# EasyEDA Pro project Pajero Gauges.epro, schematic Schematic1

## Sheets
1 12V In / Protection: Board Name: PCB1; Create Date: 2026-03-26; Page Name: 12V In / Protection; Project Name: Pajero Gauges Current V2; Schematic Name: Schematic1; Update Date: 2026-03-26; Company: EasyEDA.com; Page Size: A4; Version: V1.0
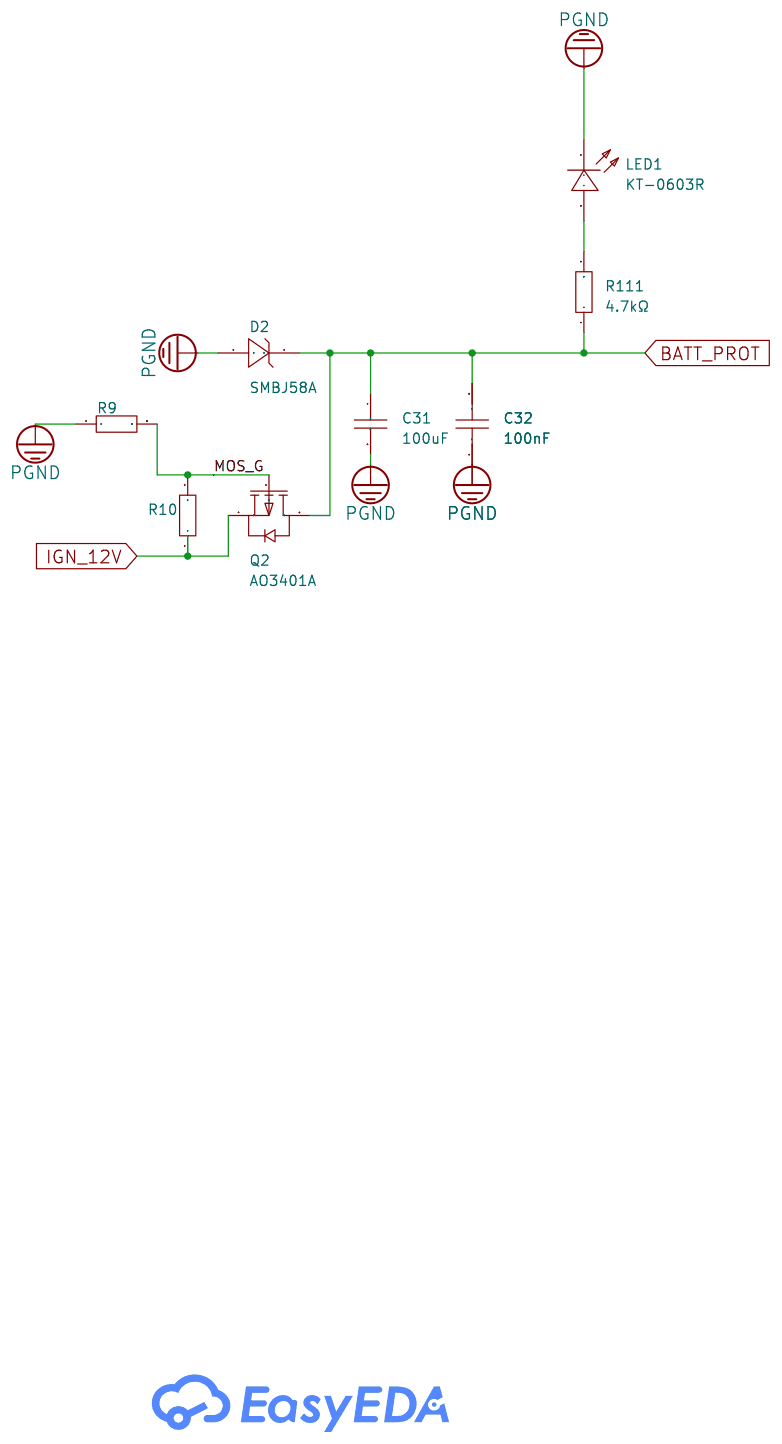
[diagram p0: 12V In / Protection]
2 3.3V Buck: Create Date: 2026-03-25; Page Name: 3.3V Buck; Project Name: Pajero Gauges Current; Update Date: 2026-03-25
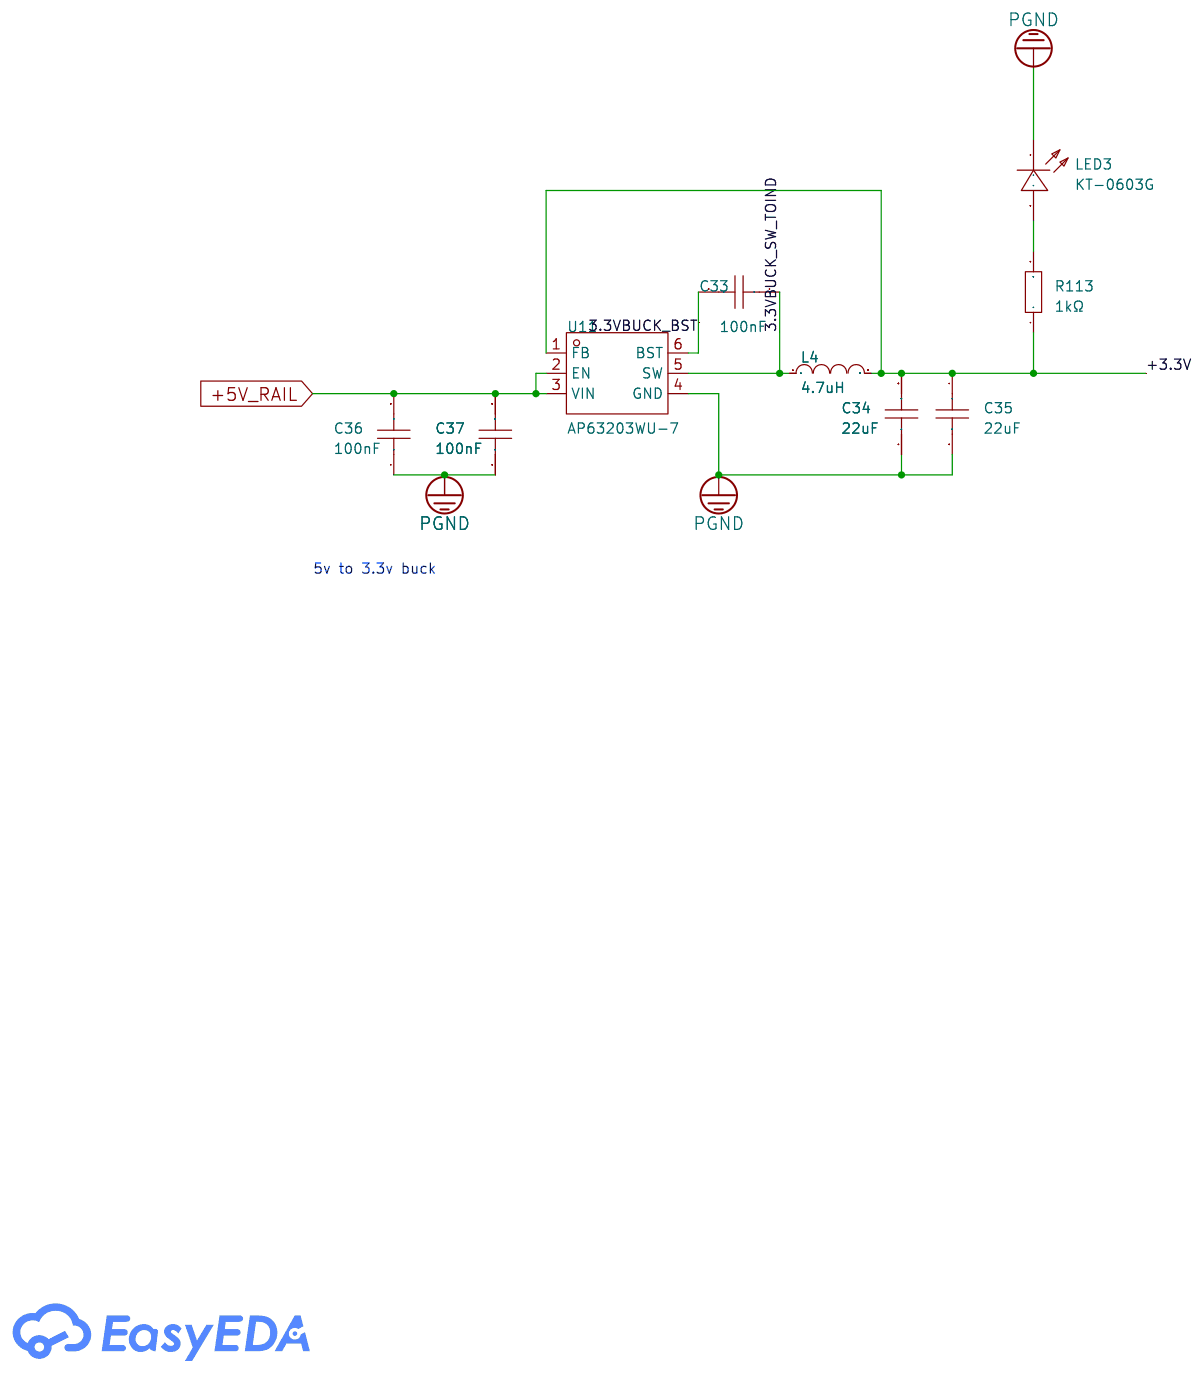
[diagram p1: 3.3V Buck]
3 Thermocouple: Page Name: Thermocouple
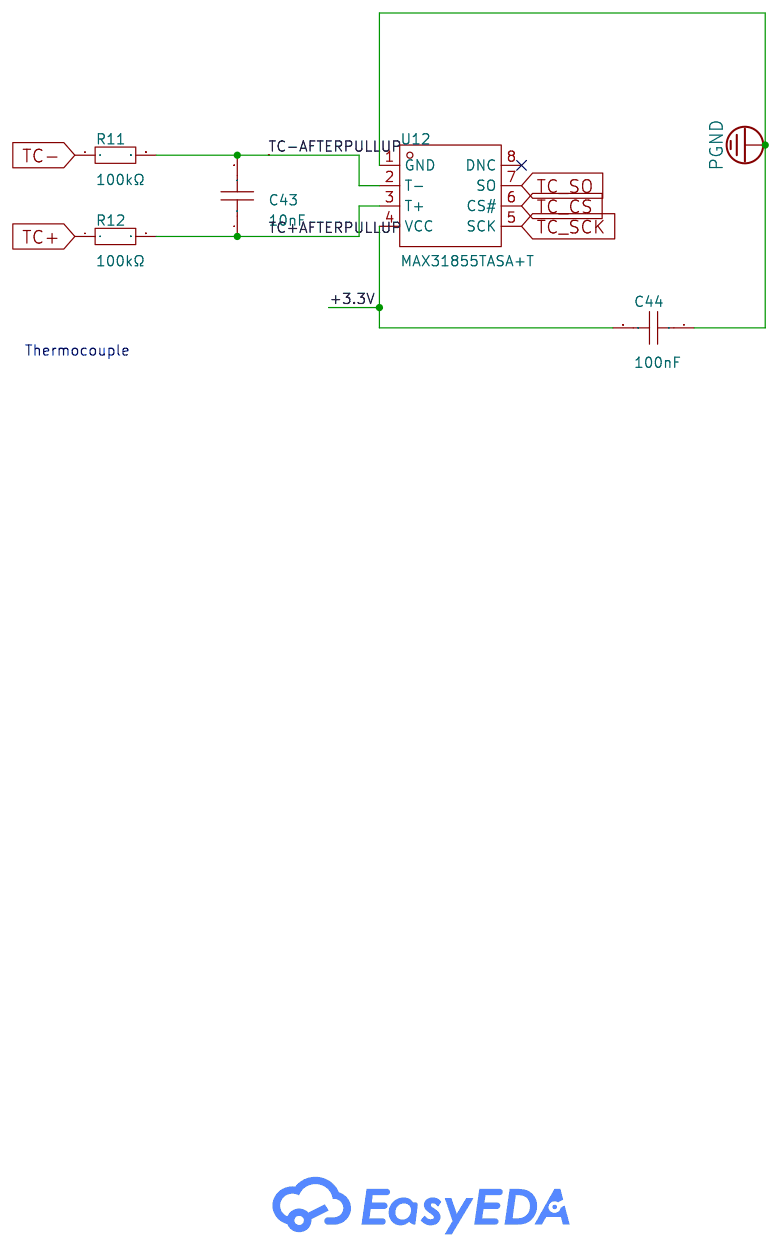
[diagram p2: Thermocouple]
4 Voltage Dividers: Create Date: 2026-03-19; Page Name: Voltage Dividers; Project Name: Pajero Gauges Current; Update Date: 2026-03-20
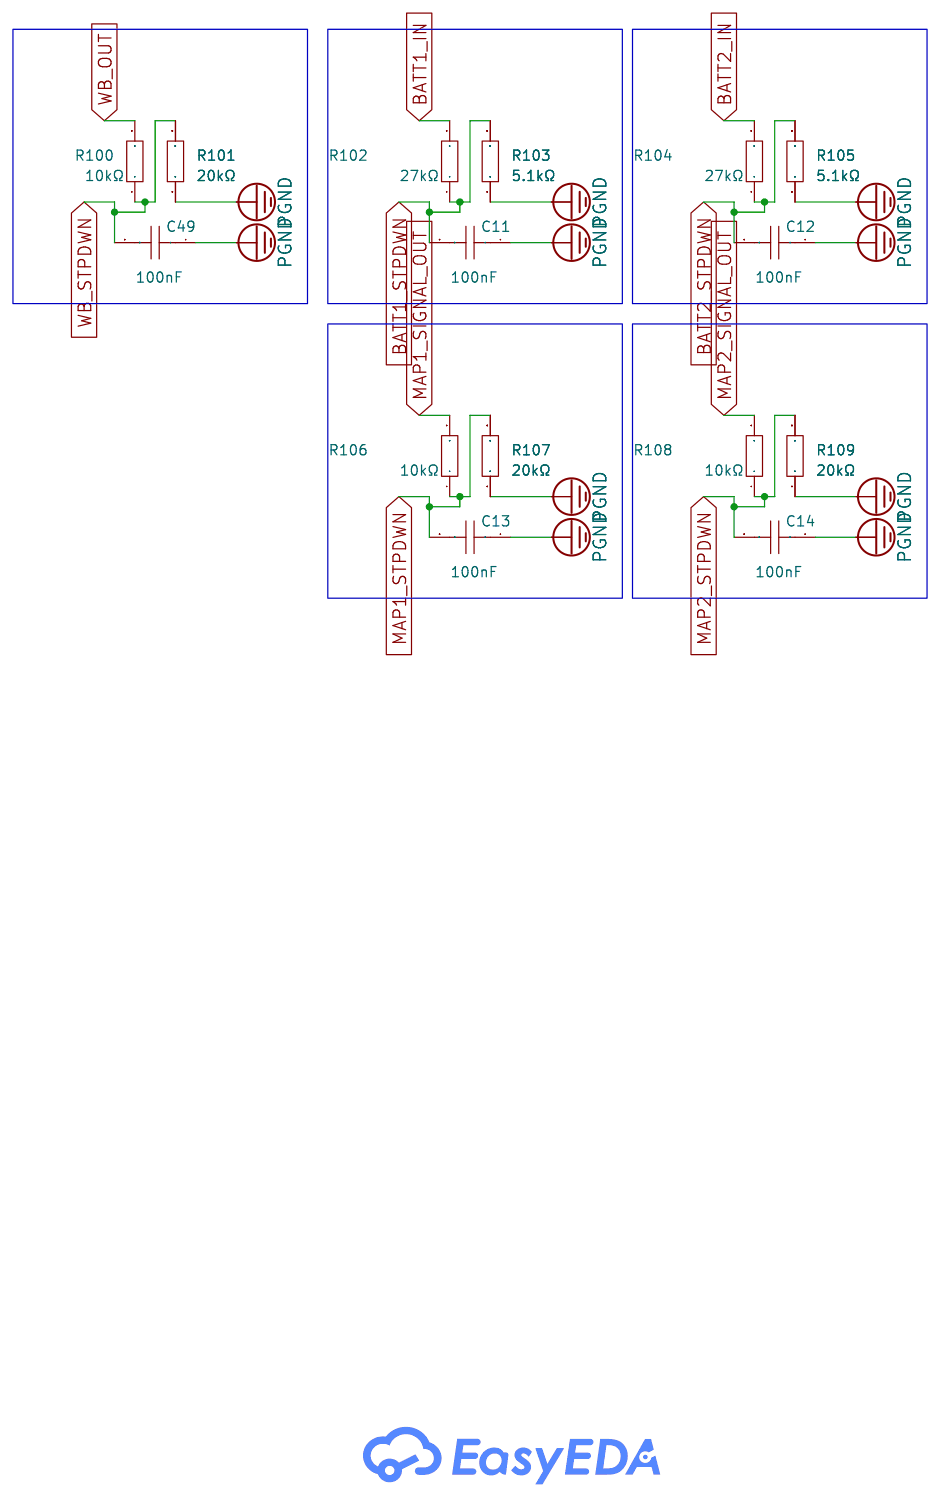
[diagram p3: Voltage Dividers]
5 Wideband: Create Date: 2026-03-20; Page Name: P1; Project Name: Project Name; Schematic Name: Schematic Name; Update Date: 2021.11.05
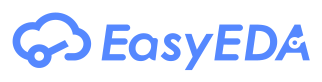
[diagram p4: Wideband]
6 OLEDs: Create Date: 2026-03-20; Page Name: OLEDs; Project Name: Pajero Gauges Current; Update Date: 2026-03-23
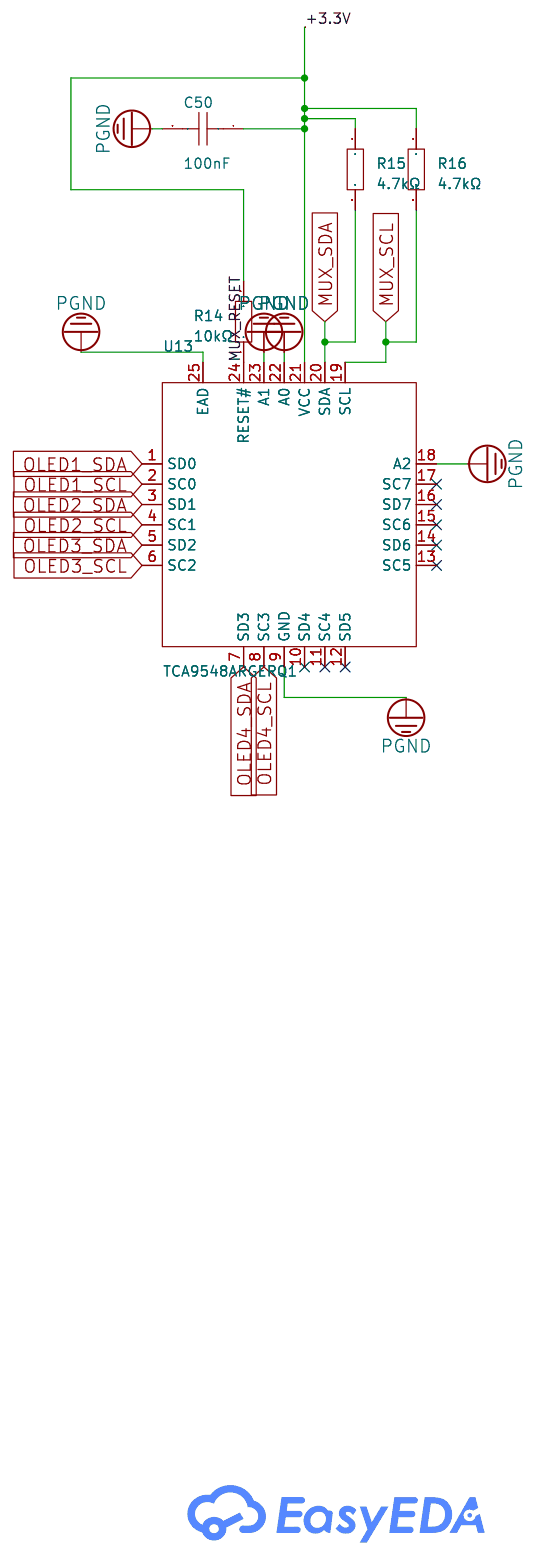
[diagram p5: OLEDs]
7 ESP32: Page Name: ESP32
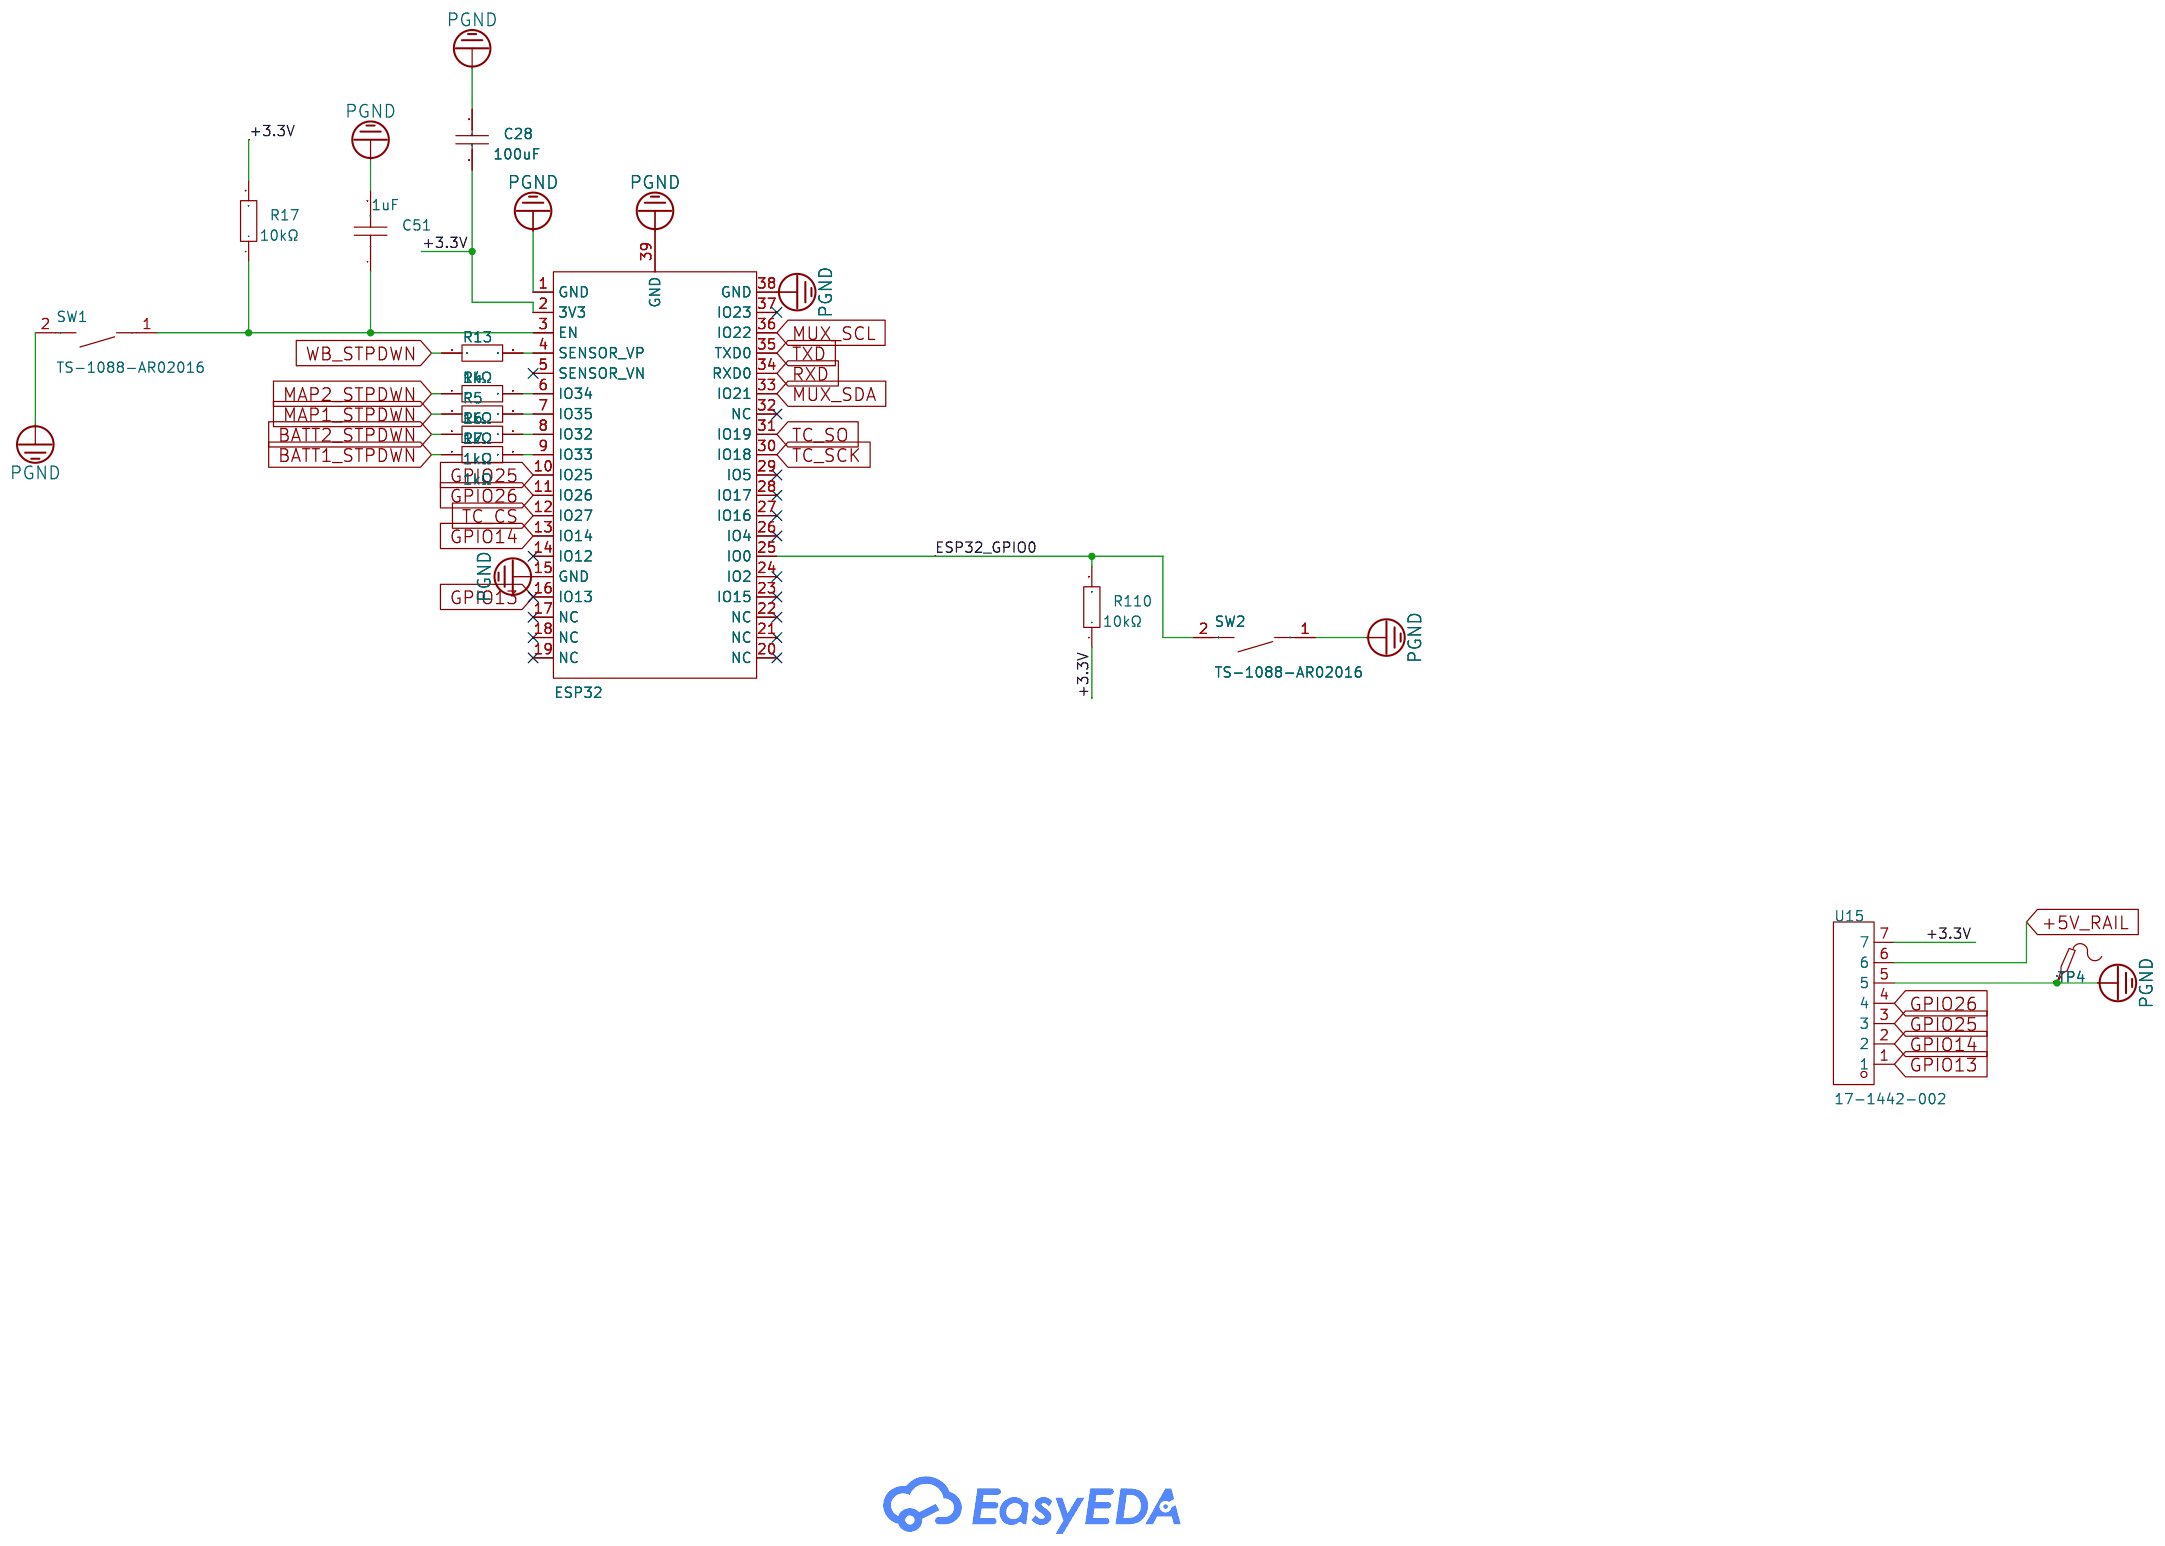
[diagram p6: ESP32]
8 5V Buck: Create Date: 2026-03-25; Page Name: 5V Buck; Project Name: Pajero Gauges Current; Update Date: 2026-03-25
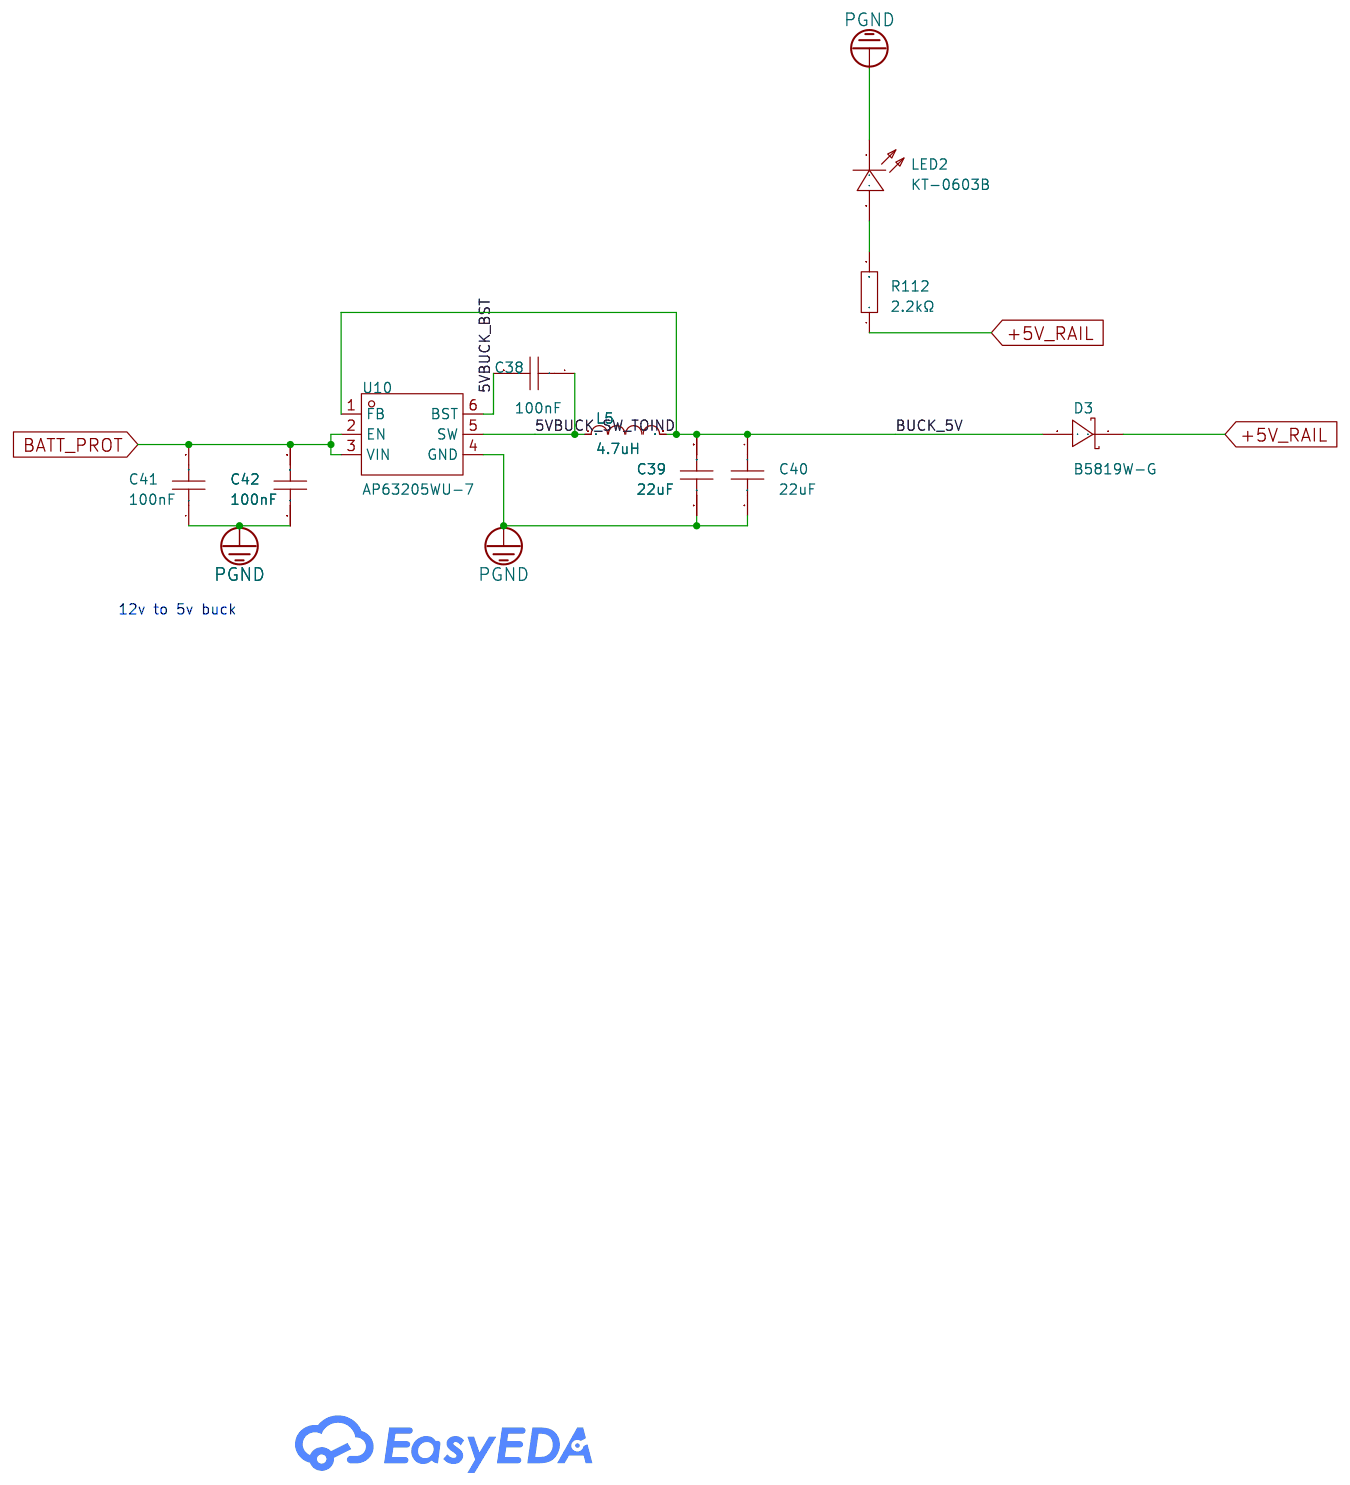
[diagram p7: 5V Buck]
9 Board In/Out Connections: Create Date: 2026-03-25; Page Name: Board In/Out Connections; Project Name: Pajero Gauges Current; Update Date: 2026-03-25
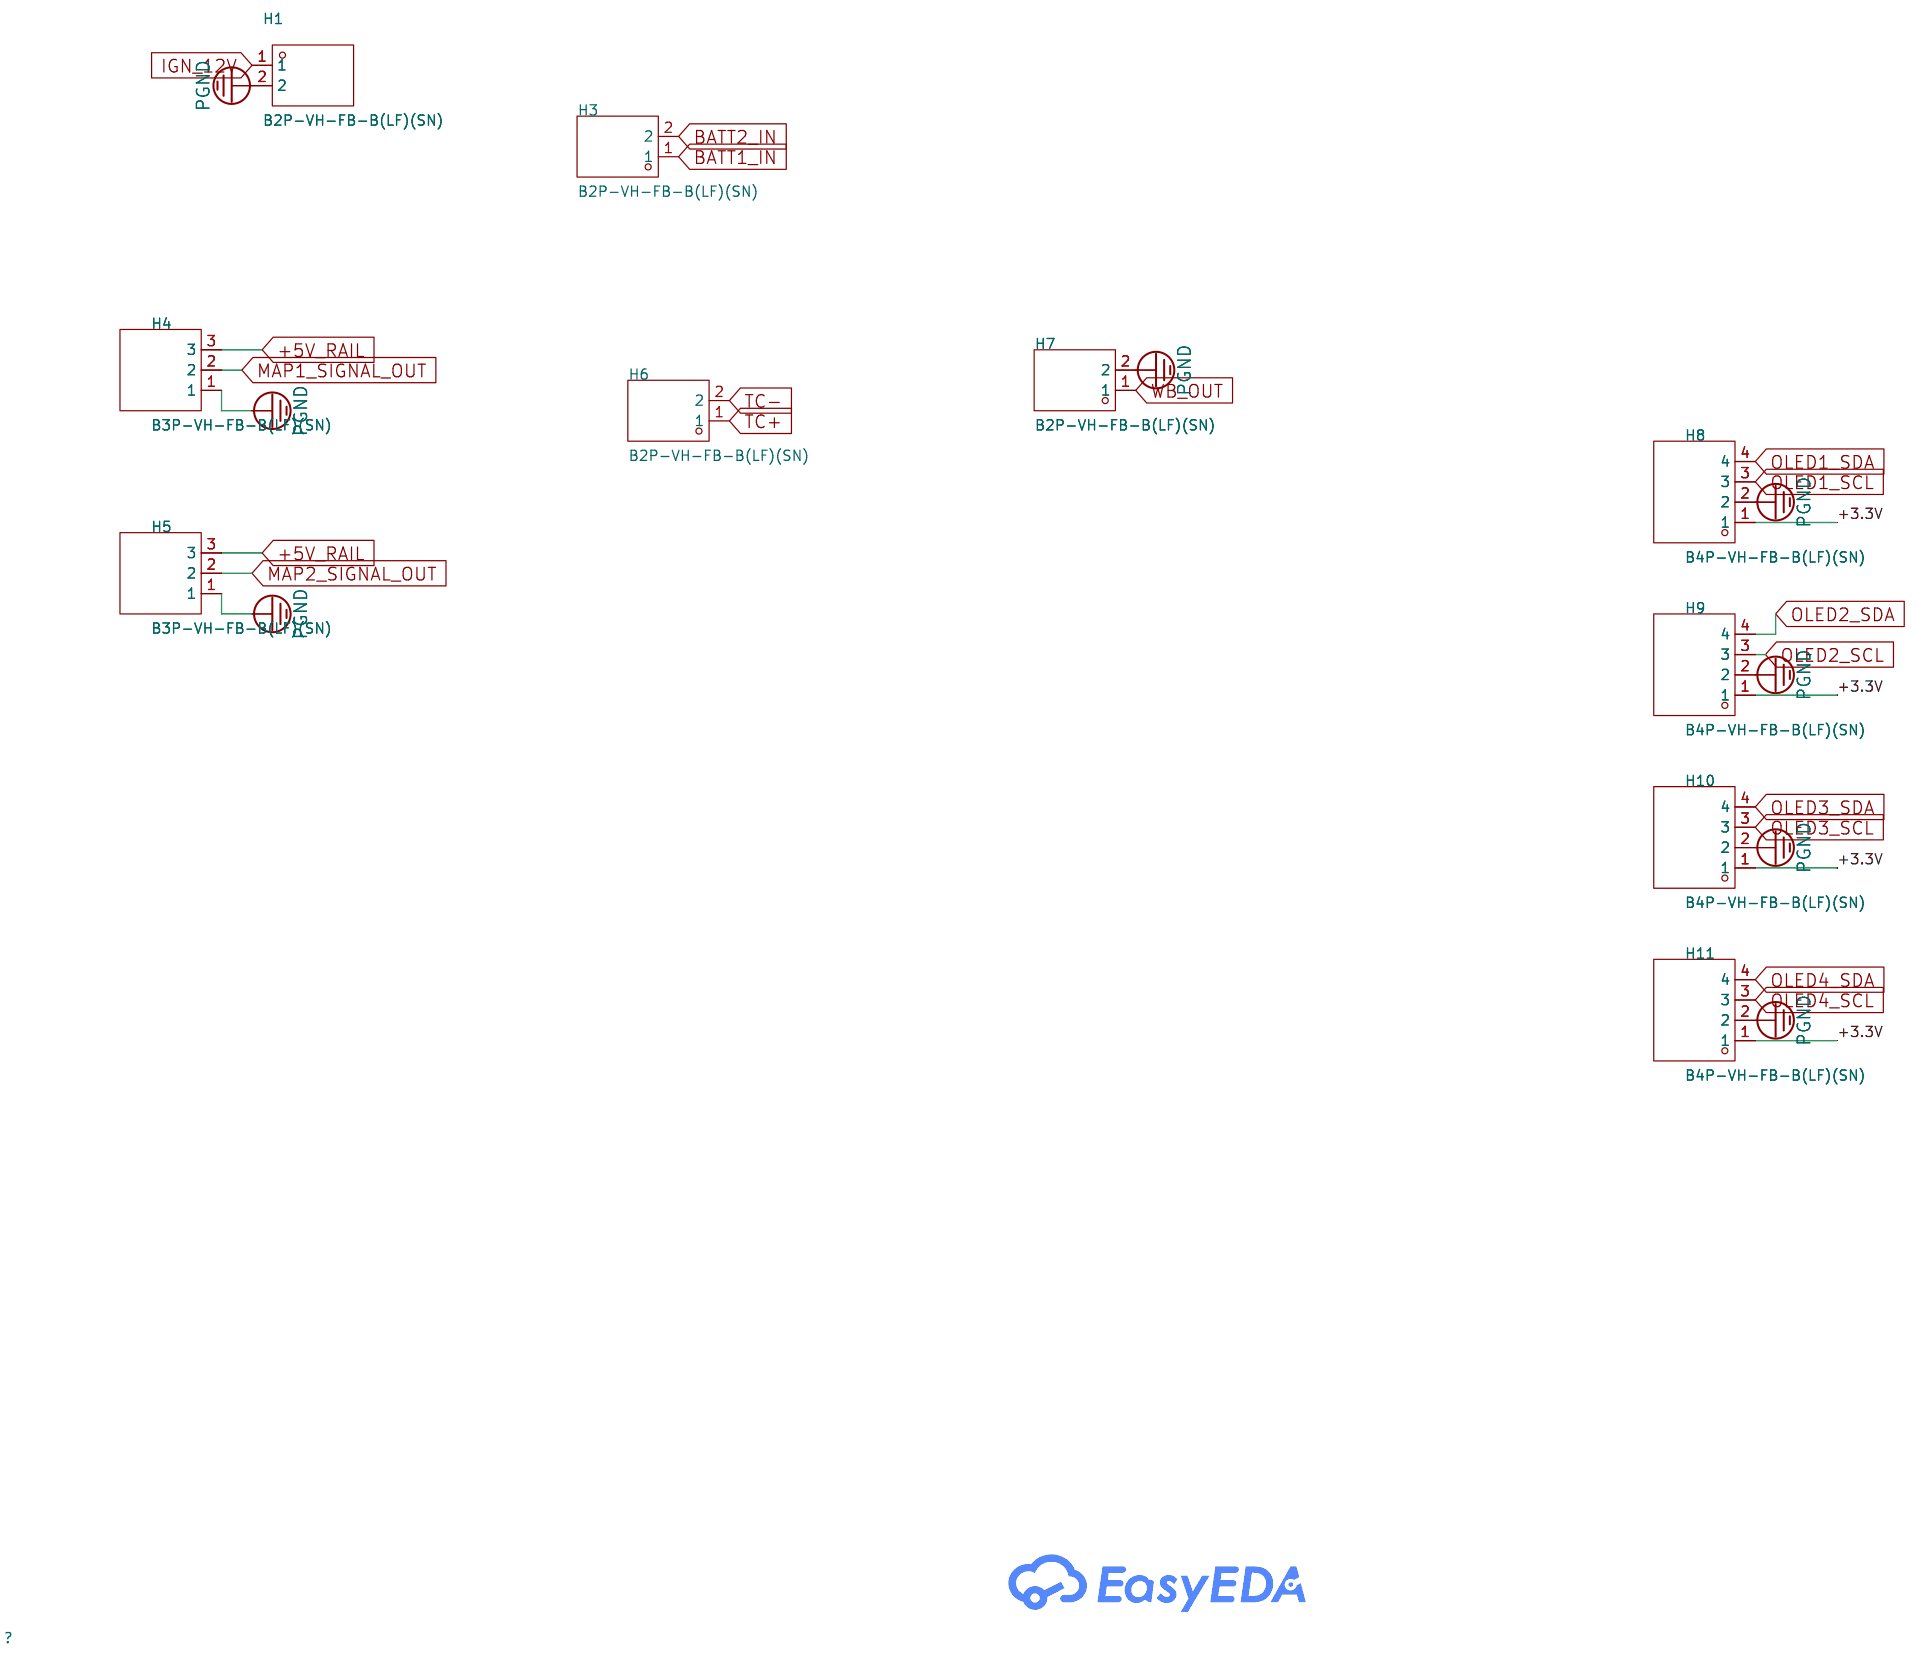
[diagram p8: Board In/Out Connections]
10 USB: Page Name: USB; Project Name: Pajero Gauges Current
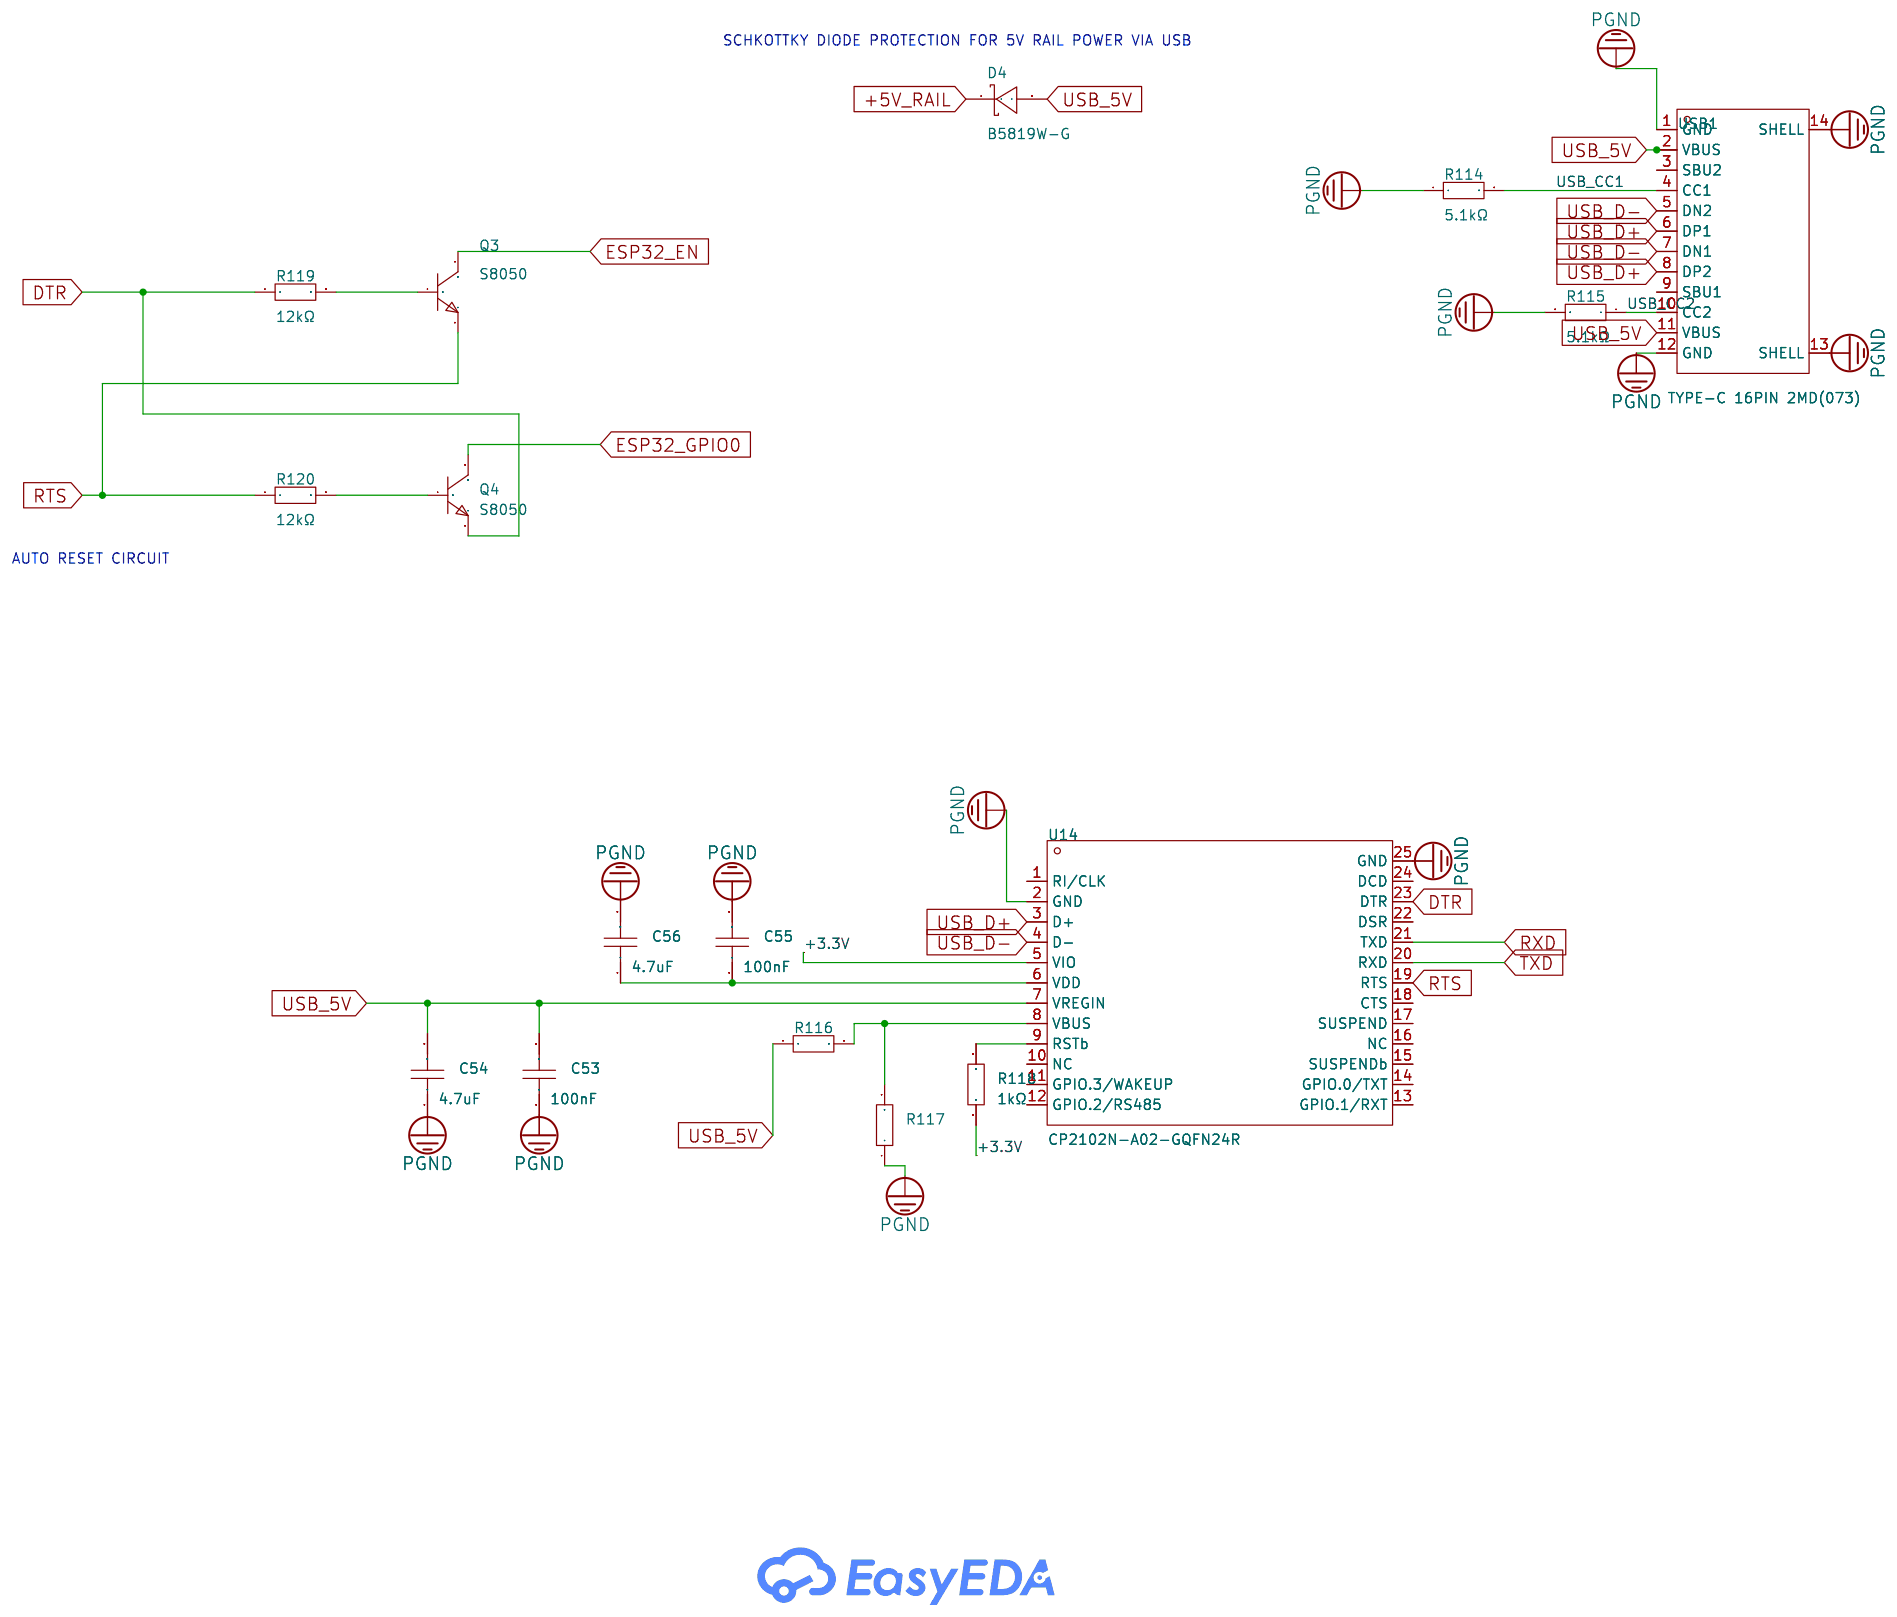
[diagram p9: USB]
11 Updated ESP32: Page Name: Updated ESP32
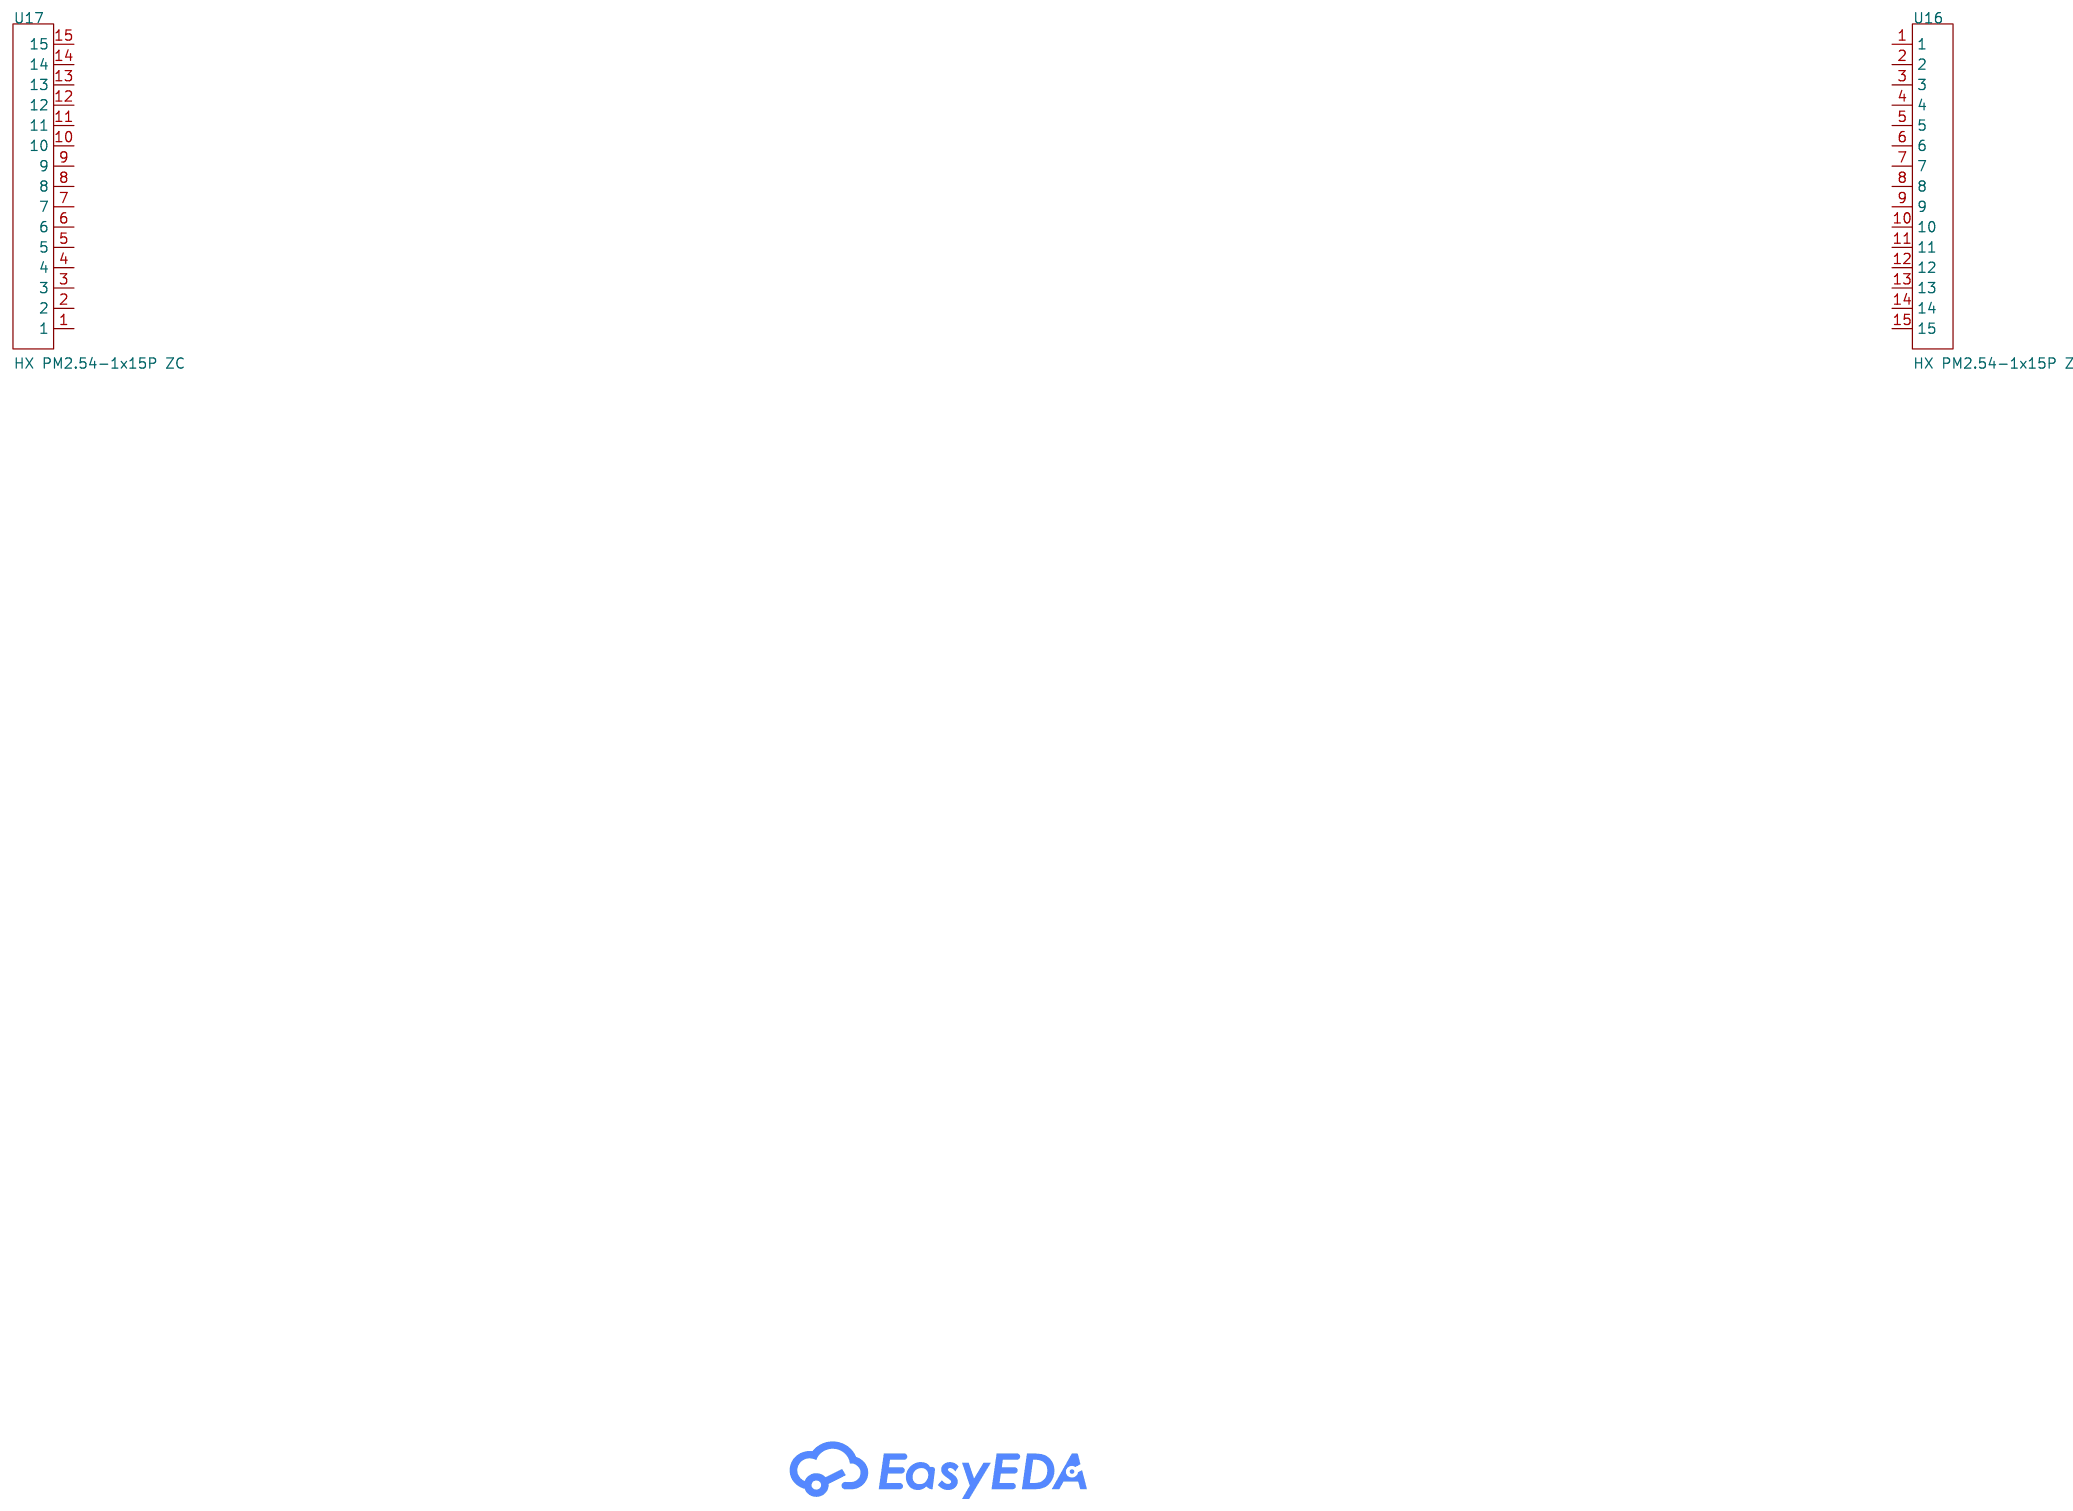
[diagram p10: Updated ESP32]

## Parts
sheet 3.3V Buck
C33  100nF  [C0603]
C34  22uF  [C0603]
C35  22uF  [C0603]
C36  100nF  [C0603]
C37  100nF  [C0603]
L4  4.7uH  [IND-SMD_L4.0-W4.0_FNR40XXS]
LED3  KT-0603G  [LED0603-RD]
R113  1kΩ  [R0603]
U11  AP63203WU-7  [TSOT-26_L2.9-W1.6-P0.95-LS2.8-BL]
sheet 5V Buck
C38  100nF  [C0603]
C39  22uF  [C0603]
C40  22uF  [C0603]
C41  100nF  [C0603]
C42  100nF  [C0603]
D3  B5819W-G  [SOD-123_L2.7-W1.6-LS3.7-RD-1]
L5  4.7uH  [IND-SMD_L4.0-W4.0_FNR40XXS]
LED2  KT-0603B  [LED0603-RD]
R112  2.2kΩ  [R0603]
U10  AP63205WU-7  [TSOT-23-6_L2.9-W1.6-P0.95-LS2.8-BL]
sheet 12V In / Protection
C31  100uF  [C1206]
C32  100nF  [C0603]
D2  SMBJ58A  [SMB_L4.4-W3.6-LS5.2-RD]
LED1  KT-0603R  [LED0603-RD]
Q2  AO3401A  [SOT-23-3_L2.9-W1.3-P1.90-LS2.4-BR]
R9  100kΩ  [R0603]
R10  100kΩ  [R0603]
R111  4.7kΩ  [R0603]
sheet Board In/Out Connections
H1  B2P-VH-FB-B(LF)(SN)  [CONN-TH_2P-P3.96_B2P-VH-FB-B-LF-SN]
H3  B2P-VH-FB-B(LF)(SN)  [CONN-TH_2P-P3.96_B2P-VH-FB-B-LF-SN]
H4  B3P-VH-FB-B(LF)(SN)  [CONN-TH_B3P-VH-FB-B-LF-SN]
H5  B3P-VH-FB-B(LF)(SN)  [CONN-TH_B3P-VH-FB-B-LF-SN]
H6  B2P-VH-FB-B(LF)(SN)  [CONN-TH_2P-P3.96_B2P-VH-FB-B-LF-SN]
H7  B2P-VH-FB-B(LF)(SN)  [CONN-TH_2P-P3.96_B2P-VH-FB-B-LF-SN]
H8  B4P-VH-FB-B(LF)(SN)  [CONN-TH_B4P-VH-FB-B-LF-SN]
H9  B4P-VH-FB-B(LF)(SN)  [CONN-TH_B4P-VH-FB-B-LF-SN]
H10  B4P-VH-FB-B(LF)(SN)  [CONN-TH_B4P-VH-FB-B-LF-SN]
H11  B4P-VH-FB-B(LF)(SN)  [CONN-TH_B4P-VH-FB-B-LF-SN]
sheet ESP32
C28  100uF  [C1206]
C51  1uF  [C0603]
ESP32  ESP32-WROOM-32E-N4  [WIFI-SMD_ESP32-WROOM-32E]
R4  1kΩ  [R0603]
R5  1kΩ  [R0603]
R6  1kΩ  [R0603]
R7  1kΩ  [R0603]
R13  1kΩ  [R0603]
R17  10kΩ  [R0603]
R110  10kΩ  [R0603]
SW1  TS-1088-AR02016  [SW-SMD_L3.9-W3.0-P4.45]
SW2  TS-1088-AR02016  [SW-SMD_L3.9-W3.0-P4.45]
TP4  -  [Test-Point-0.5mm]
U15  17-1442-002  [HDR-TH_7P-P2.54-V-M]
sheet OLEDs
C50  100nF  [C0603]
R14  10kΩ  [R0603]
R15  4.7kΩ  [R0603]
R16  4.7kΩ  [R0603]
U13  TCA9548ARGERQ1  [VQFN-24_L4.0-W4.0-P0.50-TL-EP2.8]
sheet Thermocouple
C43  10nF  [C0603]
C44  100nF  [C0603]
R11  100kΩ  [R0603]
R12  100kΩ  [R0603]
U12  MAX31855TASA+T  [SOIC-8_L4.9-W3.9-P1.27-LS6.2-BL]
sheet Updated ESP32
U16  HX PM2.54-1x15P ZC  [HDR-TH_15P-P2.54-V-F-1]
U17  HX PM2.54-1x15P ZC  [HDR-TH_15P-P2.54-V-F-1]
sheet USB
C53  100nF  [C0603]
C54  4.7uF  [C0603]
C55  100nF  [C0603]
C56  4.7uF  [C0603]
D4  B5819W-G  [SOD-123_L2.7-W1.6-LS3.7-RD-1]
Q3  S8050  [SOT-23-3_L2.9-W1.3-P1.90-LS2.4-BR]
Q4  S8050  [SOT-23-3_L2.9-W1.3-P1.90-LS2.4-BR]
R114  5.1kΩ  [R0603]
R115  5.1kΩ  [R0603]
R116  22.1kΩ  [R0603]
R117  47.5kΩ  [R0603]
R118  1kΩ  [R0603]
R119  12kΩ  [R0603]
R120  12kΩ  [R0603]
U14  CP2102N-A02-GQFN24R  [QFN-24_L4.0-W4.0-P0.50-TL-EP2.6]
USB1  TYPE-C 16PIN 2MD(073)  [USB-C-SMD_TYPE-C-6PIN-2MD-073]
sheet Voltage Dividers
C11  100nF  [C0603]
C12  100nF  [C0603]
C13  100nF  [C0603]
C14  100nF  [C0603]
C49  100nF  [C0603]
R100  10kΩ  [R0603]
R101  20kΩ  [R0603]
R102  27kΩ  [R0603]
R103  5.1kΩ  [R0603]
R104  27kΩ  [R0603]
R105  5.1kΩ  [R0603]
R106  10kΩ  [R0603]
R107  20kΩ  [R0603]
R108  10kΩ  [R0603]
R109  20kΩ  [R0603]

## Library data of the parts
C11-C14 C32 C33 C36-C38 C41 C42 C49 C50 C53 C55 = CC0603KRX7R9BB104: Capacitance:100nF Tolerance:±10% Tolerance:±10% Voltage Rating:50V Temperature Coefficient:X7R; LCSC Part Name: 100nF ±10% 50V; Supplier Part: C14663; Manufacturer: YAGEO(国巨); Supplier Footprint: 0603; JLCPCB Part Class: Basic Part; Datasheet: https://item.szlcsc.com/datasheet/CC0603KRX7R9BB104/15331.html; Supplier: LCSC; Tolerance: ±10%; Voltage Rating: 50V; Temperature Coefficient: X7R
C34 C35 C39 C40 = CL10A226MQ8NRNC: Capacitance:22uF Tolerance:±20% Tolerance:±20% Voltage Rating:6.3V Temperature Coefficient:X5R; LCSC Part Name: 22uF ±20% 6.3V; Supplier Part: C59461; Manufacturer: SAMSUNG(三星); Supplier Footprint: 0603; JLCPCB Part Class: Basic Part; Datasheet: https://item.szlcsc.com/datasheet/CL10A226MQ8NRNC/60514.html; Supplier: LCSC; Tolerance: ±20%; Voltage Rating: 6.3V; Temperature Coefficient: X5R
L4 L5 = FNR4030S4R7MT: Inductance:4.7uH Tolerance:±20% Tolerance:±20% Current Rating:2.3A Current - Saturation(Isat):3.2A DC Resistance(DCR):78mΩ Type:Magnetic Core Shielded Winding Alloy Inductor; LCSC Part Name: 4.7uH ±20% 3.2A; Supplier Part: C167874; Manufacturer: cjiang(长江微电); Supplier Footprint: SMD,4x4mm; JLCPCB Part Class: Extended Part; Datasheet: https://atta.szlcsc.com/upload/public/pdf/source/20190327/C167925_9EFF0AABC4CA629C2CC95961DBF7D39D.pdf; Supplier: LCSC; Tolerance: ±20%; Current Rating: 2.3A; Current - Saturation(Isat): 3.2A; DC Resistance(DCR): 78mΩ; Type: Magnetic Core Shielded Winding Alloy Inductor
LED3 = KT-0603G: Lamp Holder Type:- Illumination Color:Emerald Green Voltage - Forward(Vf):3.1V Voltage - Forward(Vf):3.1V Power(Watts):100mW Forward Current:5mA Wavelength - Dominant:513nm~528nm Wavelength - Dominant:513nm~528nm Peak Wavelength:525nm Diode Configuration:; LCSC Part Name: 0603 翠绿 高亮; Supplier Part: C12624; Manufacturer: KENTO; Supplier Footprint: 0603; JLCPCB Part Class: Extended Part; Datasheet: https://item.szlcsc.com/datasheet/KT-0603G/13258.html; Supplier: LCSC; Illumination Color: Emerald Green; Voltage - Forward(Vf): 3.1V; Power(Watts): 100mW; Forward Current: 5mA; Wavelength - Dominant: 513nm~528nm; Peak Wavelength: 525nm; Diode Configuration: Discrete Diode; Lens Color: Water Clear; Luminous Intensity: 430mcd; Viewing Angle: 120°; Operating Temperature: -40℃~+85℃
R4-R7 R13 R113 R118 = 0603WAF1001T5E: Type:Thick Film Resistor Resistance:1kΩ Tolerance:±1% Tolerance:±1% Power(Watts):100mW Voltage-Supply(Max):75V Temperature Coefficient:±100ppm/℃ Temperature Coefficient:±100ppm/℃ Operating Temperature:-55℃~+155℃ Operating Temperature:-55℃~+155℃; LCSC Part Name: 1kΩ ±1% 100mW 厚膜电阻; Supplier Part: C21190; Manufacturer: UNI-ROYAL(厚声); Supplier Footprint: 0603; JLCPCB Part Class: Basic Part; Datasheet: https://item.szlcsc.com/datasheet/0603WAF1001T5E/21904.html; Supplier: LCSC; Type: Thick Film Resistor; Tolerance: ±1%; Power(Watts): 100mW; Voltage-Supply(Max): 75V; Temperature Coefficient: ±100ppm/℃; Operating Temperature: -55℃~+155℃
U11 = AP63203WU-7: Function:Buck Voltage - Supply:3.8V~32V Voltage - Supply:3.8V~32V Output Voltage:3.3V Output Voltage:3.3V Output Current:2A Frequency - Switching:1.1MHz Frequency - Switching:1.1MHz Operating Temperature:-40℃~+85℃@(TA) Operating Temperature:-40℃~+85℃@(TA); LCSC Part Name: 3.8V至32V输入、2A低静态电流同步降压转换器，增强EMI抑制; Supplier Part: C780769; Manufacturer: DIODES(美台); Supplier Footprint: TSOT-23-6; JLCPCB Part Class: Extended Part; Datasheet: https://item.szlcsc.com/datasheet/AP63203WU-7/832852.html; Supplier: LCSC; Function: Buck; Voltage - Supply: 3.8V~32V; Output Voltage: 3.3V; Output Current: 2A; Frequency - Switching: 1.1MHz; Operating Temperature: -40℃~+85℃@(TA); Synchronous Rectifier: Yes; Number of Outputs: 1; Topology: Buck; Quiescent Current: 22uA; Switch tube (built-in/external): Built-In; Output Type: Fixed; Check: true
D3 D4 = B5819W-G: Voltage - Forward(Vf@If):600mV@1A Voltage - DC Reverse(Vr):40V Current - Rectified:1A Non-Repetitive Peak Forward Surge Current:9A; LCSC Part Name: 丝印：SL 电压:40V 电流:1A; Supplier Part: C164911; Manufacturer: CJ(江苏长电/长晶); Supplier Footprint: SOD-123; JLCPCB Part Class: Extended Part; Datasheet: https://item.szlcsc.com/datasheet/B5819W-G/176293.html; Supplier: LCSC; Voltage - Forward(Vf@If): 600mV@1A; Voltage - DC Reverse(Vr): 40V; Current - Rectified: 1A; Non-Repetitive Peak Forward Surge Current: 9A
LED2 = KT-0603B: Lamp Holder Type:- Illumination Color:Blue Voltage - Forward(Vf):3.1V Voltage - Forward(Vf):3.1V Power(Watts):100mW Forward Current:5mA Wavelength - Dominant:460nm~475nm Wavelength - Dominant:460nm~475nm Peak Wavelength:469nm Diode Configuration:Discrete; LCSC Part Name: 0603 蓝灯 高亮; Supplier Part: C2288; Manufacturer: KENTO; Supplier Footprint: 0603; JLCPCB Part Class: Extended Part; Datasheet: https://item.szlcsc.com/datasheet/KT-0603B/2661.html; Supplier: LCSC; Illumination Color: Blue; Voltage - Forward(Vf): 3.1V; Power(Watts): 100mW; Forward Current: 5mA; Wavelength - Dominant: 460nm~475nm; Peak Wavelength: 469nm; Diode Configuration: Discrete Diode; Lens Color: Water Clear; Luminous Intensity: 175mcd; Viewing Angle: 120°
R112 = 0603WAF2201T5E_C4190: Type:Thick Film Resistors Resistance:2.2kΩ Tolerance:±1% Tolerance:±1% Power(Watts): Overload Voltage (Max): Temperature Coefficient:±100ppm/℃ Temperature Coefficient:±100ppm/℃ Operating Temperature Range:-55℃~+155℃ Operating Temperature Range:-55℃~+155℃; LCSC Part Name: 2.2kΩ ±1% 100mW 厚膜电阻; Supplier Part: C4190; Manufacturer: UNI-ROYAL(厚声); Manufacturer Part: 0603WAF2201T5E; Supplier Footprint: 0603; JLCPCB Part Class: Basic Part; Datasheet: https://atta.szlcsc.com/upload/public/pdf/source/20200306/C422600_1E6D84923E4A46A82E41ADD87F860B5C.pdf; Supplier: LCSC; Type: Thick Film Resistors; Tolerance: ±1%; Temperature Coefficient: ±100ppm/℃; Operating Temperature Range: -55℃~+155℃
U10 = AP63205WU-7: Function:Buck Voltage - Supply:3.8V~32V Voltage - Supply:3.8V~32V Output Voltage:5V Output Voltage:5V Output Current:2A Frequency - Switching:1.1MHz Frequency - Switching:1.1MHz Operating Temperature:-40℃~+85℃@(TA) Operating Temperature:-40℃~+85℃@(TA) Syn; LCSC Part Name: 3.8V至32V输入、2A低静态电流同步降压转换器，增强EMI抑制; Supplier Part: C2071056; Manufacturer: DIODES(美台); Supplier Footprint: TSOT-23-6; JLCPCB Part Class: Extended Part; Datasheet: https://item.szlcsc.com/datasheet/AP63205WU-7/2162639.html; Supplier: LCSC; Function: Buck; Voltage - Supply: 3.8V~32V; Output Voltage: 5V; Output Current: 2A; Frequency - Switching: 1.1MHz; Operating Temperature: -40℃~+85℃@(TA); Synchronous Rectifier: Yes; Number of Outputs: 1; Topology: Buck; Quiescent Current: 22uA; Switch tube (built-in/external): Built-In; Output Type: Fixed; Check: true
C28 C31 = CL31A107MQHNNNE: Capacitance:100uF Tolerance:±20% Tolerance:±20% Voltage Rating:6.3V Temperature Coefficient:X5R; LCSC Part Name: 100uF ±20% 6.3V; Supplier Part: C15008; Manufacturer: SAMSUNG(三星); Supplier Footprint: 1206; JLCPCB Part Class: Basic Part; Datasheet: https://item.szlcsc.com/datasheet/CL31A107MQHNNNE/15681.html; Supplier: LCSC; Tolerance: ±20%; Voltage Rating: 6.3V; Temperature Coefficient: X5R
D2 = SMBJ58A_C3012531: Polarity:Unidirectional Reverse Stand-Off Voltage (Vrwm):58V Clamping Voltage:93.6V Peak Pulse Current (Ipp):6.5A Peak Pulse Power Dissipation (Ppp):600W Voltage - Breakdown:64.4V Reverse Leakage Current (Ir):1uA Type:TVS; Supplier Part: C3012531; Manufacturer: PAKER(派克微); Supplier Footprint: SMB; JLCPCB Part Class: Extended Part; Datasheet: https://atta.szlcsc.com/upload/public/pdf/source/20220607/3D2A7659A4820C4AE9AE78D6D582D662.pdf; Supplier: LCSC; Polarity: Unidirectional; Reverse Stand-Off Voltage (Vrwm): 58V; Clamping Voltage: 93.6V; Peak Pulse Current (Ipp): 6.5A; Peak Pulse Power Dissipation (Ppp): 600W; Voltage - Breakdown: 64.4V; Reverse Leakage Current (Ir): 1uA; Type: TVS; Check: true
LED1 = KT-0603R: Lamp Holder Type:- Illumination Color:Red Voltage - Forward(Vf):1.8V~2.4V Voltage - Forward(Vf):1.8V~2.4V Power(Watts):40mW Forward Current:20mA Wavelength - Dominant:615nm~630nm Wavelength - Dominant:615nm~630nm Peak Wavelength:645nm Diode Configuration:; LCSC Part Name: 0603 红灯 高亮; Supplier Part: C2286; Manufacturer: KENTO; Supplier Footprint: 0603; JLCPCB Part Class: Basic Part; Datasheet: https://item.szlcsc.com/datasheet/KT-0603R/2659.html; Supplier: LCSC; Illumination Color: Red; Voltage - Forward(Vf): 1.8V~2.4V; Power(Watts): 40mW; Forward Current: 20mA; Wavelength - Dominant: 615nm~630nm; Peak Wavelength: 645nm; Diode Configuration: Discrete Diode; Lens Color: Water Clear; Luminous Intensity: 300mcd; Viewing Angle: 120°; Operating Temperature: -40℃~+85℃
Q2 = AO3401A: Drain to Source Voltage:30V Current - Continuous Drain(Id):4.2A RDS(on):55mΩ@10V,4.2A Pd - Power Dissipation:1.2W Gate Threshold Voltage (Vgs(th)):- Gate Charge(Qg):8.5nC Input Capacitance(Ciss):880pF@15V Reverse Transfer Capacitance (Crss@Vds):65pF@15V O; LCSC Part Name: 耐压:30V 电流:4.2A; Supplier Part: C5122001; Manufacturer: TECH PUBLIC(台舟); Supplier Footprint: SOT-23; JLCPCB Part Class: Extended Part; Datasheet: https://item.szlcsc.com/datasheet/AO3401A/5710587.html; Supplier: LCSC; Drain to Source Voltage: 30V; Current - Continuous Drain(Id): 4.2A; RDS(on): 55mΩ@10V,4.2A; Pd - Power Dissipation: 1.2W; Gate Charge(Qg): 8.5nC; Input Capacitance(Ciss): 880pF@15V; Reverse Transfer Capacitance (Crss@Vds): 65pF@15V; Operating Temperature: -55℃~+150℃; Check: true
R9-R12 = 0603WAF1003T5E: Type:Thick Film Resistor Resistance:100kΩ Tolerance:±1% Tolerance:±1% Power(Watts):100mW Voltage-Supply(Max):75V Temperature Coefficient:±100ppm/℃ Temperature Coefficient:±100ppm/℃ Operating Temperature:-55℃~+155℃ Operating Temperature:-55℃~+155℃; LCSC Part Name: 100kΩ ±1% 100mW 厚膜电阻; Supplier Part: C25803; Manufacturer: UNI-ROYAL(厚声); Supplier Footprint: 0603; JLCPCB Part Class: Basic Part; Datasheet: https://item.szlcsc.com/datasheet/0603WAF1003T5E/26546.html; Supplier: LCSC; Type: Thick Film Resistor; Tolerance: ±1%; Power(Watts): 100mW; Voltage-Supply(Max): 75V; Temperature Coefficient: ±100ppm/℃; Operating Temperature: -55℃~+155℃
R15 R16 R111 = 0603WAF4701T5E: Type:Thick Film Resistor Resistance:4.7kΩ Tolerance:±1% Tolerance:±1% Power(Watts):100mW Voltage-Supply(Max):75V Temperature Coefficient:±100ppm/℃ Temperature Coefficient:±100ppm/℃ Operating Temperature:-55℃~+155℃ Operating Temperature:-55℃~+155℃; LCSC Part Name: 4.7kΩ ±1% 100mW 厚膜电阻; Supplier Part: C23162; Manufacturer: UNI-ROYAL(厚声); Supplier Footprint: 0603; JLCPCB Part Class: Basic Part; Datasheet: https://item.szlcsc.com/datasheet/0603WAF4701T5E/23889.html; Supplier: LCSC; Type: Thick Film Resistor; Tolerance: ±1%; Power(Watts): 100mW; Voltage-Supply(Max): 75V; Temperature Coefficient: ±100ppm/℃; Operating Temperature: -55℃~+155℃
H1 H3 H6 H7 = B2P-VH-FB-B(LF)(SN): Pins Structure:1x2P Pitch:3.96mm Mounting Type:Through Hole Reference Series:VH Number of Pins:2P Number of Rows:1 Number of PINs Per Row:2 Row Spacing:- Current Rating:10A Contact Material:Copper Alloy Contact Plating:Tin Operating Temperature:-25℃~+85℃; LCSC Part Name: 1x2P 间距:3.96mm 直插 系列:VH; Supplier Part: C158006; Manufacturer: JST; Supplier Footprint: 插件,P=3.96mm; JLCPCB Part Class: Extended Part; Datasheet: https://item.szlcsc.com/datasheet/B2P-VH-FB-B(LF)(SN)/169354.html; Supplier: LCSC; Pins Structure: 1x2P; Pitch: 3.96mm; Mounting Type: Through Hole; Reference Series: VH; Number of Pins: 2P; Number of Rows: 1; Number of PINs Per Row: 2; Current Rating: 10A; Contact Material: Copper Alloy; Contact Plating: Tin; Operating Temperature: -25℃~+85℃; Voltage Rating: 250V; Plastic Material: Glass-Fiber Reinforced PBT; Flame Retardant Rating: UL94V-0; Supplementary Features: Pillar; Color: White; Z-Height of the Board: 11mm; X-Length of Bottom Edge on Board (Spacing Line): 9.8mm; Y-Width of Bottom Edge on Board: 9.7mm
H4 H5 = B3P-VH-FB-B(LF)(SN): Pins Structure:1x3P Pitch:3.96mm Mounting Type:Through Hole Reference Series:VH Number of Pins:3P Number of Rows:1 Number of PINs Per Row:3 Row Spacing:- Current Rating:10A Contact Material:Copper Alloy Contact Plating:Tin Operating Temperature:-25℃~+85℃; LCSC Part Name: 1x3P 间距:3.96mm 直插 系列:VH; Supplier Part: C158000; Manufacturer: JST; Supplier Footprint: 插件,P=3.96mm; JLCPCB Part Class: Extended Part; Datasheet: https://item.szlcsc.com/datasheet/B3P-VH-FB-B(LF)(SN)/169348.html; Supplier: LCSC; Pins Structure: 1x3P; Pitch: 3.96mm; Mounting Type: Through Hole; Reference Series: VH; Number of Pins: 3P; Number of Rows: 1; Number of PINs Per Row: 3; Current Rating: 10A; Contact Material: Copper Alloy; Contact Plating: Tin; Operating Temperature: -25℃~+85℃; Voltage Rating: 250V; Plastic Material: Glass-Fiber Reinforced PBT; Flame Retardant Rating: UL94V-0; Supplementary Features: Pillar; Color: White; Z-Height of the Board: 11mm; X-Length of Bottom Edge on Board (Spacing Line): 13.76mm; Y-Width of Bottom Edge on Board: 9.7mm
H8-H11 = B4P-VH-FB-B(LF)(SN): Pins Structure:1x4P Pitch:3.96mm Mounting Type:Through Hole Reference Series:VH Number of Pins:4P Number of Rows:1 Number of PINs Per Row:4 Row Spacing:- Current Rating:10A Contact Material:Copper Alloy Contact Plating:Tin Operating Temperature:-25℃~+85℃; LCSC Part Name: 1x4P 间距:3.96mm 直插 系列:VH; Supplier Part: C157995; Manufacturer: JST; Supplier Footprint: 插件,P=3.96mm; JLCPCB Part Class: Extended Part; Datasheet: https://item.szlcsc.com/datasheet/B4P-VH-FB-B(LF)(SN)/169343.html; Supplier: LCSC; Pins Structure: 1x4P; Pitch: 3.96mm; Mounting Type: Through Hole; Reference Series: VH; Number of Pins: 4P; Number of Rows: 1; Number of PINs Per Row: 4; Current Rating: 10A; Contact Material: Copper Alloy; Contact Plating: Tin; Operating Temperature: -25℃~+85℃; Voltage Rating: 250V; Plastic Material: Glass-Fiber Reinforced PBT; Flame Retardant Rating: UL94V-0; Supplementary Features: Pillar; Color: White; Z-Height of the Board: 11mm; X-Length of Bottom Edge on Board (Spacing Line): 17.72mm; Y-Width of Bottom Edge on Board: 9.7mm
C51 = CL10A105KB8NNNC: Capacitance:1uF Tolerance:±10% Tolerance:±10% Voltage Rating:50V Temperature Coefficient:X5R; LCSC Part Name: 1uF ±10% 50V; Supplier Part: C15849; Manufacturer: SAMSUNG(三星); Supplier Footprint: 0603; JLCPCB Part Class: Basic Part; Datasheet: https://item.szlcsc.com/datasheet/CL10A105KB8NNNC/16531.html; Supplier: LCSC; Tolerance: ±10%; Voltage Rating: 50V; Temperature Coefficient: X5R
ESP32 = ESP32-WROOM-32E-N4: LCSC Part Name: 通用型Wi-Fi+BT+BLE MCU模组; Supplier Part: C701341; Manufacturer: ESPRESSIF(乐鑫); Supplier Footprint: SMD,25.5x18mm; JLCPCB Part Class: Extended Part; Datasheet: https://item.szlcsc.com/datasheet/ESP32-WROOM-32E-N4/736349.html; Supplier: LCSC
R14 R17 R100 R106 R108 R110 = 0603WAF1002T5E: Type:Thick Film Resistor Resistance:10kΩ Tolerance:±1% Tolerance:±1% Power(Watts):100mW Voltage-Supply(Max):75V Temperature Coefficient:±100ppm/℃ Temperature Coefficient:±100ppm/℃ Operating Temperature:-55℃~+155℃ Operating Temperature:-55℃~+155℃; LCSC Part Name: 厚膜电阻 10kΩ ±1% 100mW; Supplier Part: C25804; Manufacturer: UNI-ROYAL(厚声); Supplier Footprint: 0603; JLCPCB Part Class: Basic Part; Datasheet: https://item.szlcsc.com/datasheet/0603WAF1002T5E/26547.html; Supplier: LCSC; Type: Thick Film Resistor; Tolerance: ±1%; Power(Watts): 100mW; Voltage-Supply(Max): 75V; Temperature Coefficient: ±100ppm/℃; Operating Temperature: -55℃~+155℃
SW1 SW2 = TS-1088-AR02016: Circuit:SPST Actuator Style:Round Button Operating Force:1.6N Mounting Type:Surface Mount,Vertical Length:4mm Width:3mm Switch Height:2mm with Bracket:Without Bracket Contact Current:50mA Voltage Rating:12V Actuator/Cap Color:Black Termination Style:SMD(S; LCSC Part Name: 4*3*2mm 立贴 轻触开关; Supplier Part: C720477; Manufacturer: XUNPU(讯普); Supplier Footprint: SMD,4x3mm; JLCPCB Part Class: Basic Part; Datasheet: https://item.szlcsc.com/datasheet/TS-1088-AR02016/763484.html; Supplier: LCSC; Circuit: SPST; Actuator Style: Round Button; Operating Force: 1.6N; Mounting Type: Surface Mount,Vertical; Length: 4mm; Width: 3mm; Switch Height: 2mm; with Bracket: Without Bracket; Contact Current: 50mA; Voltage Rating: 12V; Actuator/Cap Color: Black; Termination Style: SMD(SMT) Tab; Life: 100,000 Cycles; Operating Temperature: -30℃~+80℃
TP4 = Test-Point: Test Point 测试点
U15 = 17-1442-002: Pin Structure:1x7P Pitch:2.54mm Circluar Pins/Square Pins:Pin Header Mounting Type:Through Hole Number of Rows:1 Number of Pins:7P Current Rating:3A Insulation Height:2.5mm Length of End Connection Pin:3mm Contact Material:Brass Contact Plating:Gold Opera; LCSC Part Name: 1x7P 间距:2.54mm 方针 直插; Supplier Part: C6800657; Manufacturer: 皇捷; Supplier Footprint: 插件,P=2.54mm; JLCPCB Part Class: Extended Part; Datasheet: https://item.szlcsc.com/datasheet/17-1442-002/7761023.html; Supplier: LCSC; Pin Structure: 1x7P; Pitch: 2.54mm; Circluar Pins/Square Pins: Pin Header; Mounting Type: Through Hole; Number of Rows: 1; Number of Pins: 7P; Current Rating: 3A; Insulation Height: 2.5mm; Length of End Connection Pin: 3mm; Contact Material: Brass; Contact Plating: Gold; Operating Temperature: -40℃~+105℃
U13 = TCA9548ARGERQ1: LCSC Part Name: 支持复位的汽车8通道I2C开关; Supplier Part: C2674697; Manufacturer: TI(德州仪器); Supplier Footprint: VQFN-24-EP(4x4); JLCPCB Part Class: Extended Part; Datasheet: https://www.ti.com/cn/lit/gpn/tca9548a-q1; Supplier: LCSC; Check: true
C43 C44 = FCC0603B103K500CT: Capacitance:10nF Tolerance:±10% Tolerance:±10% Voltage Rating:50V Temperature Coefficient:X7R; LCSC Part Name: 10nF ±10% 50V; Supplier Part: C5137477; Manufacturer: FOJAN(富捷); Supplier Footprint: 0603; JLCPCB Part Class: Extended Part; Datasheet: https://item.szlcsc.com/datasheet/FCC0603B103K500CT/5746979.html; Supplier: LCSC; Tolerance: ±10%; Voltage Rating: 50V; Temperature Coefficient: X7R
U12 = MAX31855TASA+T: Resolution:14 Number of Channels:- Voltage - Supply:3V~3.6V Voltage - Supply:3V~3.6V Interface Type:SPI Chip Type Parameters/Description:Cold Junction Compensation Thermocouple to Digital Converter Operating Temperature:-40℃~+125℃ Operating Temperature:-4; LCSC Part Name: 冷端补偿热电偶转数字转换器; Supplier Part: C476183; Manufacturer: ADI(亚德诺)/MAXIM(美信); Supplier Footprint: SO-8; JLCPCB Part Class: Extended Part; Datasheet: https://item.szlcsc.com/datasheet/MAX31855TASA%252BT/483089.html; Supplier: LCSC; Resolution: 14; Voltage - Supply: 3V~3.6V; Interface Type: SPI; Chip Type Parameters/Description: Cold Junction Compensation Thermocouple to Digital Converter; Operating Temperature: -40℃~+125℃
U16 U17 = HX PM2.54-1x15P ZC: Holes Structure:1x15P Pitch:2.54mm Row Spacing:- Circular Hole / Square Hole:Square Hole Mounting Type:Through Hole Number of Rows:1 Number of Positions:15P Current Rating:3A Voltage Rating (Max):1kV Holes Direction:Top Insulation Height:8.5mm Contact Mat; LCSC Part Name: 1x15P 间距:2.54mm 直插; Supplier Part: C41417327; Manufacturer: hanxia(韩下); Supplier Footprint: 插件,P=2.54mm; JLCPCB Part Class: Extended Part; Datasheet: https://item.szlcsc.com/datasheet/HX%2520PM2.54-1x15P%2520ZC/43243331.html; Supplier: LCSC; Holes Structure: 1x15P; Pitch: 2.54mm; Circular Hole / Square Hole: Square Hole; Mounting Type: Through Hole; Number of Rows: 1; Number of Positions: 15P; Current Rating: 3A; Voltage Rating (Max): 1kV; Holes Direction: Top; Insulation Height: 8.5mm; Contact Material: Brass; Contact Plating: Gold; Operating Temperature: -40℃~+105℃; PIN Length: 3.2mm
C54 C56 = CL10A475KO8NNNC: Capacitance:4.7uF Tolerance:±10% Tolerance:±10% Voltage Rating:16V Temperature Coefficient:X5R; LCSC Part Name: 4.7uF ±10% 16V; Supplier Part: C19666; Manufacturer: SAMSUNG(三星); Supplier Footprint: 0603; JLCPCB Part Class: Basic Part; Datasheet: https://item.szlcsc.com/datasheet/CL10A475KO8NNNC/20375.html; Supplier: LCSC; Tolerance: ±10%; Voltage Rating: 16V; Temperature Coefficient: X5R
Q3 Q4 = S8050_C51953468: type:NPN Current - Collector(Ic):500mA Collector - Emitter Voltage VCEO:25V Pd - Power Dissipation:300mW DC Current Gain:400@50mA,1V DC Current Gain:400@50mA,1V Transition frequency(fT):150MHz Current - Collector Cutoff:100nA Vce Saturation(VCE(sat)):600m; LCSC Part Name: S8050 hFE:120-400 NPN 晶体管 电流：500mA 电压：25V; Supplier Part: C51953468; Manufacturer: CCX(晁禾); Supplier Footprint: SOT-23; JLCPCB Part Class: Extended Part; Datasheet: https://item.szlcsc.com/datasheet/S8050/54682178.html; Supplier: LCSC; type: NPN; Current - Collector(Ic): 500mA; Collector - Emitter Voltage VCEO: 25V; Pd - Power Dissipation: 300mW; DC Current Gain: 400@50mA,1V; Transition frequency(fT): 150MHz; Current - Collector Cutoff: 100nA; Vce Saturation(VCE(sat)): 600mV@500mA,50mA; Operating Temperature: -55℃~+150℃; Emitter-Base Voltage(Vebo): 5V; Number: 1 NPN Transistor
R103 R105 R114 R115 = 0603WAF5101T5E: Type:Thick Film Resistor Resistance:5.1kΩ Tolerance:±1% Tolerance:±1% Power(Watts):100mW Voltage-Supply(Max):75V Temperature Coefficient:±100ppm/℃ Temperature Coefficient:±100ppm/℃ Operating Temperature:-55℃~+155℃ Operating Temperature:-55℃~+155℃; LCSC Part Name: 5.1kΩ ±1% 100mW 厚膜电阻; Supplier Part: C23186; Manufacturer: UNI-ROYAL(厚声); Supplier Footprint: 0603; JLCPCB Part Class: Basic Part; Datasheet: https://item.szlcsc.com/datasheet/0603WAF5101T5E/23913.html; Supplier: LCSC; Type: Thick Film Resistor; Tolerance: ±1%; Power(Watts): 100mW; Voltage-Supply(Max): 75V; Temperature Coefficient: ±100ppm/℃; Operating Temperature: -55℃~+155℃
R116 = 0603WAF2212T5E: Type:Thick Film Resistors Resistance:22.1kΩ Tolerance:±1% Tolerance:±1% Power(Watts): Overload Voltage (Max): Temperature Coefficient:±100ppm/℃ Temperature Coefficient:±100ppm/℃ Operating Temperature Range:-55℃~+155℃ Operating Temperature Range:-55℃~+155℃; LCSC Part Name: 22.1kΩ ±1% 100mW 厚膜电阻; Supplier Part: C25961; Manufacturer: UNI-ROYAL(厚声); Supplier Footprint: 0603; JLCPCB Part Class: Extended Part; Datasheet: https://atta.szlcsc.com/upload/public/pdf/source/20200306/C422600_1E6D84923E4A46A82E41ADD87F860B5C.pdf; Supplier: LCSC; Type: Thick Film Resistors; Tolerance: ±1%; Temperature Coefficient: ±100ppm/℃; Operating Temperature Range: -55℃~+155℃
R117 = 0603WAF4752T5E: Type:Thick Film Resistor Resistance:47.5kΩ Tolerance:±1% Tolerance:±1% Power(Watts):100mW Voltage-Supply(Max):75V Temperature Coefficient:±100ppm/℃ Temperature Coefficient:±100ppm/℃ Operating Temperature:-55℃~+155℃ Operating Temperature:-55℃~+155℃; LCSC Part Name: 47.5kΩ ±1% 100mW 厚膜电阻; Supplier Part: C23061; Manufacturer: UNI-ROYAL(厚声); Supplier Footprint: 0603; JLCPCB Part Class: Extended Part; Datasheet: https://item.szlcsc.com/datasheet/0603WAF4752T5E/23788.html; Supplier: LCSC; Type: Thick Film Resistor; Tolerance: ±1%; Power(Watts): 100mW; Voltage-Supply(Max): 75V; Temperature Coefficient: ±100ppm/℃; Operating Temperature: -55℃~+155℃
R119 R120 = 0603WAF1202T5E: Type:Thick Film Resistor Resistance:12kΩ Tolerance:±1% Tolerance:±1% Power(Watts):100mW Voltage-Supply(Max):75V Temperature Coefficient:±100ppm/℃ Temperature Coefficient:±100ppm/℃ Operating Temperature:-55℃~+155℃ Operating Temperature:-55℃~+155℃; LCSC Part Name: 12kΩ ±1% 100mW 厚膜电阻; Supplier Part: C22790; Manufacturer: UNI-ROYAL(厚声); Supplier Footprint: 0603; JLCPCB Part Class: Basic Part; Datasheet: https://item.szlcsc.com/datasheet/0603WAF1202T5E/23517.html; Supplier: LCSC; Type: Thick Film Resistor; Tolerance: ±1%; Power(Watts): 100mW; Voltage-Supply(Max): 75V; Temperature Coefficient: ±100ppm/℃; Operating Temperature: -55℃~+155℃
U14 = CP2102N-A02-GQFN24R: Applications Function:USB to UART USB Protocol:USB 2.0 Voltage - Supply:3V~3.6V Voltage - Supply:3V~3.6V Operating Temperature:-40℃~+85℃@(Ta) Operating Temperature:-40℃~+85℃@(Ta) Current - Supply:9.5mA Supply Current (Iq):1.3uA; LCSC Part Name: USB转UART桥接器; Supplier Part: C969151; Manufacturer: SKYWORKS/SILICON LABS(芯科); Supplier Footprint: QFN-24-EP(4x4); JLCPCB Part Class: Extended Part; Datasheet: https://item.szlcsc.com/datasheet/CP2102N-A02-GQFN24R/1058352.html; Supplier: LCSC; Applications Function: USB to UART; USB Protocol: USB 2.0; Voltage - Supply: 3V~3.6V; Operating Temperature: -40℃~+85℃@(Ta); Current - Supply: 9.5mA; Supply Current (Iq): 1.3uA
USB1 = TYPE-C 16PIN 2MD(073): Connector Type:Type-C Protocol Standard:- Gender:Female Mounting Type:Surface Mount, Right Angle Number of Contacts:16P Number of Ports:1 Current Rating-Power:3A Voltage Rating:5V Connect-Disconnect Life:10,000 Cycles Supplementary Features:- Center Heigh; LCSC Part Name: Type-C 母 卧贴; Supplier Part: C2765186; Manufacturer: SHOU HAN(首韩); Supplier Footprint: SMD; JLCPCB Part Class: Extended Part; Datasheet: https://item.szlcsc.com/datasheet/TYPE-C%252016PIN%25202MD(073)/2901843.html; Supplier: LCSC; Connector Type: Type-C; Gender: Female; Mounting Type: Surface Mount, Right Angle; Number of Contacts: 16P; Number of Ports: 1; Current Rating-Power: 3A; Voltage Rating: 5V; Connect-Disconnect Life: 10,000 Cycles; Detection color: Black; Operating Temperature: -25℃~+85℃
R101 R107 R109 = 0603WAF2002T5E: Type:Thick Film Resistor Resistance:20kΩ Tolerance:±1% Tolerance:±1% Power(Watts):100mW Voltage-Supply(Max):75V Temperature Coefficient:±100ppm/℃ Temperature Coefficient:±100ppm/℃ Operating Temperature:-55℃~+155℃ Operating Temperature:-55℃~+155℃; LCSC Part Name: 20kΩ ±1% 100mW 厚膜电阻; Supplier Part: C4184; Manufacturer: UNI-ROYAL(厚声); Supplier Footprint: 0603; JLCPCB Part Class: Basic Part; Datasheet: https://item.szlcsc.com/datasheet/0603WAF2002T5E/4591.html; Supplier: LCSC; Type: Thick Film Resistor; Tolerance: ±1%; Power(Watts): 100mW; Voltage-Supply(Max): 75V; Temperature Coefficient: ±100ppm/℃; Operating Temperature: -55℃~+155℃
R102 R104 = 0603WAF2702T5E: Type:Thick Film Resistor Resistance:27kΩ Tolerance:±1% Tolerance:±1% Power(Watts):100mW Voltage-Supply(Max):75V Temperature Coefficient:±100ppm/℃ Temperature Coefficient:±100ppm/℃ Operating Temperature:-55℃~+155℃ Operating Temperature:-55℃~+155℃; LCSC Part Name: 27kΩ ±1% 100mW 厚膜电阻; Supplier Part: C22967; Manufacturer: UNI-ROYAL(厚声); Supplier Footprint: 0603; JLCPCB Part Class: Basic Part; Datasheet: https://item.szlcsc.com/datasheet/0603WAF2702T5E/23694.html; Supplier: LCSC; Type: Thick Film Resistor; Tolerance: ±1%; Power(Watts): 100mW; Voltage-Supply(Max): 75V; Temperature Coefficient: ±100ppm/℃; Operating Temperature: -55℃~+155℃

## Nets
3.3VBUCK_BST: C33.2 U11.6(BST)
3.3VBUCK_SW_TOIND: C33.1 L4.1 U11.5(SW)
5VBUCK_BST: C38.2 U10.6(BST)
5VBUCK_SW_TOIND: C38.1 L5.1 U10.5(SW)
+3.3V: C28.1 C34.2 C35.1 C44.2 C50.1 ESP32.2(3V3) H8.1 H9.1 H10.1 H11.1 L4.2 R14.2 R15.1 R16.1 R17.2 R110.1 R113.1 R118.1 U11.1(FB) U12.4(VCC) U13.21(VCC) U14.5(VIO) U15.7
+5V_RAIL: C36.2 C37.2 D3.1(K) D4.1(K) H4.3 H5.3 R112.1 U11.2(EN) U11.3(VIN) U15.6
PGND: C11.1 C12.1 C13.1 C14.1 C28.2 C31.2 C32.1 C34.1 C35.2 C36.1 C37.1 C39.1 C40.2 C41.1 C42.1 C44.1 C49.1 C50.2 C51.2 C53.1 C54.1 C55.2 C56.2 D2.2 ESP32.1(GND) ESP32.15(GND) ESP32.38(GND) ESP32.39(GND) H1.2 H4.1 H5.1 H7.2 H8.2 H9.2 H10.2 H11.2 LED1.1(K) LED2.1(K) LED3.1(K) R9.1 R101.1 R103.1 R105.1 R107.1 R109.1 R114.1 R115.2 R117.1 SW1.2 SW2.1 TP4.1 U10.4(GND) U11.4(GND) U12.1(GND) U13.9(GND) U13.18(A2) U13.22(A0) U13.23(A1) U13.25(EAD) U14.2(GND) U14.25(GND) U15.5 USB1.1(GND) USB1.12(GND) USB1.13(SHELL) USB1.14(SHELL)
BATT1_IN: H3.1 R102.2
BATT1_STPDWN: C11.2 R7.1 R102.1 R103.2
BATT2_IN: H3.2 R104.2
BATT2_STPDWN: C12.2 R6.1 R104.1 R105.2
BATT_PROT: C31.1 C32.2 C41.2 C42.2 D2.1 Q2.3(D) R111.1 U10.2(EN) U10.3(VIN)
BUCK_5V: C39.2 C40.1 D3.2(A) L5.2 U10.1(FB)
DTR: Q4.2(E) R119.1 U14.23(DTR)
ESP32_EN: C51.1 ESP32.3(EN) Q3.3(C) R17.1 SW1.1
ESP32_GPIO0: ESP32.25(IO0) Q4.3(C) R110.2 SW2.2
ESP32_IO32: ESP32.8(IO32) R6.2
ESP32_IO33: ESP32.9(IO33) R7.2
ESP32_IO34: ESP32.6(IO34) R4.2
ESP32_IO35: ESP32.7(IO35) R5.2
ESP32_SENSOR_VP: ESP32.4(SENSOR_VP) R13.2
GPIO13: ESP32.16(IO13) U15.1
GPIO14: ESP32.13(IO14) U15.2
GPIO25: ESP32.10(IO25) U15.3
GPIO26: ESP32.11(IO26) U15.4
IGN_12V: H1.1 Q2.2(S) R10.1
MAP1_SIGNAL_OUT: H4.2 R106.2
MAP1_STPDWN: C13.2 R5.1 R106.1 R107.2
MAP2_SIGNAL_OUT: H5.2 R108.2
MAP2_STPDWN: C14.2 R4.1 R108.1 R109.2
MOS_G: Q2.1(G) R9.2 R10.2
MUX_RESET: R14.1 U13.24(RESET#)
MUX_SCL: ESP32.36(IO22) R16.2 U13.19(SCL)
MUX_SDA: ESP32.33(IO21) R15.2 U13.20(SDA)
OLED1_SCL: H8.3 U13.2(SC0)
OLED1_SDA: H8.4 U13.1(SD0)
OLED2_SCL: H9.3 U13.4(SC1)
OLED2_SDA: H9.4 U13.3(SD1)
OLED3_SCL: H10.3 U13.6(SC2)
OLED3_SDA: H10.4 U13.5(SD2)
OLED4_SCL: H11.3 U13.8(SC3)
OLED4_SDA: H11.4 U13.7(SD3)
RTS: Q3.2(E) R120.1 U14.19(RTS)
RXD: ESP32.34(RXD0) U14.21(TXD)
TC+: H6.1 R12.1
TC+AFTERPULLUP: C43.1 R12.2 U12.3(T+)
TC-: H6.2 R11.1
TC-AFTERPULLUP: C43.2 R11.2 U12.2(T-)
TC_CS: ESP32.12(IO27) U12.6(CS#)
TC_SCK: ESP32.30(IO18) U12.5(SCK)
TC_SO: ESP32.31(IO19) U12.7(SO)
TXD: ESP32.35(TXD0) U14.20(RXD)
USB_5V: C53.2 C54.2 D4.2(A) R116.1 U14.7(VREGIN) USB1.2(VBUS) USB1.11(VBUS)
USB_CC1: R114.2 USB1.4(CC1)
USB_CC2: R115.1 USB1.10(CC2)
USB_D+: U14.3(D+) USB1.6(DP1) USB1.8(DP2)
USB_D-: U14.4(D-) USB1.5(DN2) USB1.7(DN1)
WB_OUT: H7.1 R100.2
WB_STPDWN: C49.2 R13.1 R100.1 R101.2
$2N5399: LED1.2(A) R111.2
$3N5671: LED3.2(A) R113.2
$9N1468: LED2.2(A) R112.2
$11N880: R116.2 R117.2 U14.8(VBUS)
$11N883: C55.1 C56.1 U14.6(VDD)
$11N890: R118.2 U14.9(RSTb)
$11N1237: Q3.1(B) R119.2
$11N1363: Q4.1(B) R120.2

Not connected (* = marked no-connect by the designer): ESP32 5(SENSOR_VN)* 14(IO12)* 17(NC)* 18(NC)* 19(NC)* 20(NC)* 21(NC)* 22(NC)* 23(IO15)* 24(IO2)* 26(IO4)* 27(IO16)* 28(IO17)* 29(IO5)* 32(NC)* 37(IO23)*; U12 8(DNC)*; U13 10(SD4)* 11(SC4)* 12(SD5)* 13(SC5)* 14(SD6)* 15(SC6)* 16(SD7)* 17(SC7)*; U14 1(RI/CLK) 10(NC) 11(GPIO.3/WAKEUP) 12(GPIO.2/RS485) 13(GPIO.1/RXT) 14(GPIO.0/TXT) 15(SUSPENDb) 16(NC) 17(SUSPEND) 18(CTS) 22(DSR) 24(DCD); U16 1 2 3 4 5 6 7 8 9 10 11 12 13 14 15; U17 1 2 3 4 5 6 7 8 9 10 11 12 13 14 15; USB1 3(SBU2) 9(SBU1)

## Notes on the sheets
sheet 2
- 5v to 3.3v buck
sheet 3
- Thermocouple
sheet 8
- 12v to 5v buck
sheet 10
- SCHKOTTKY DIODE PROTECTION FOR 5V RAIL POWER VIA USB
- AUTO RESET CIRCUIT
